# Altium project Intermediate_LCL_Updated.PrjPcb (part 1 of 2)
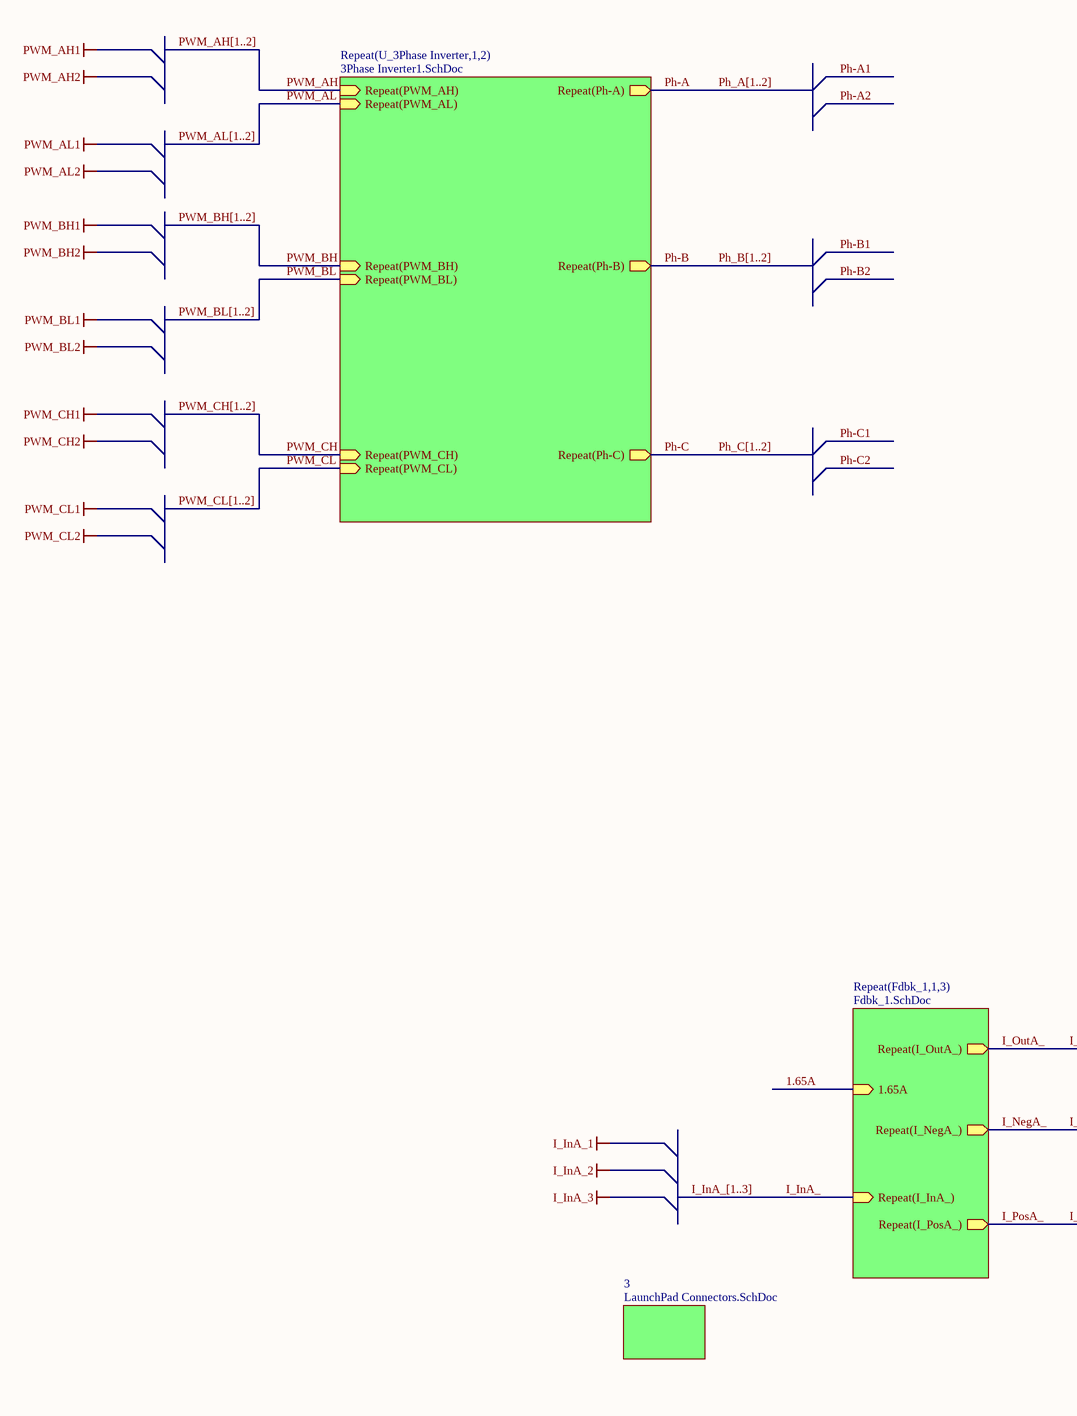
[diagram p0: Intermediate_LCL_Top_20230320.SchDoc, top left]
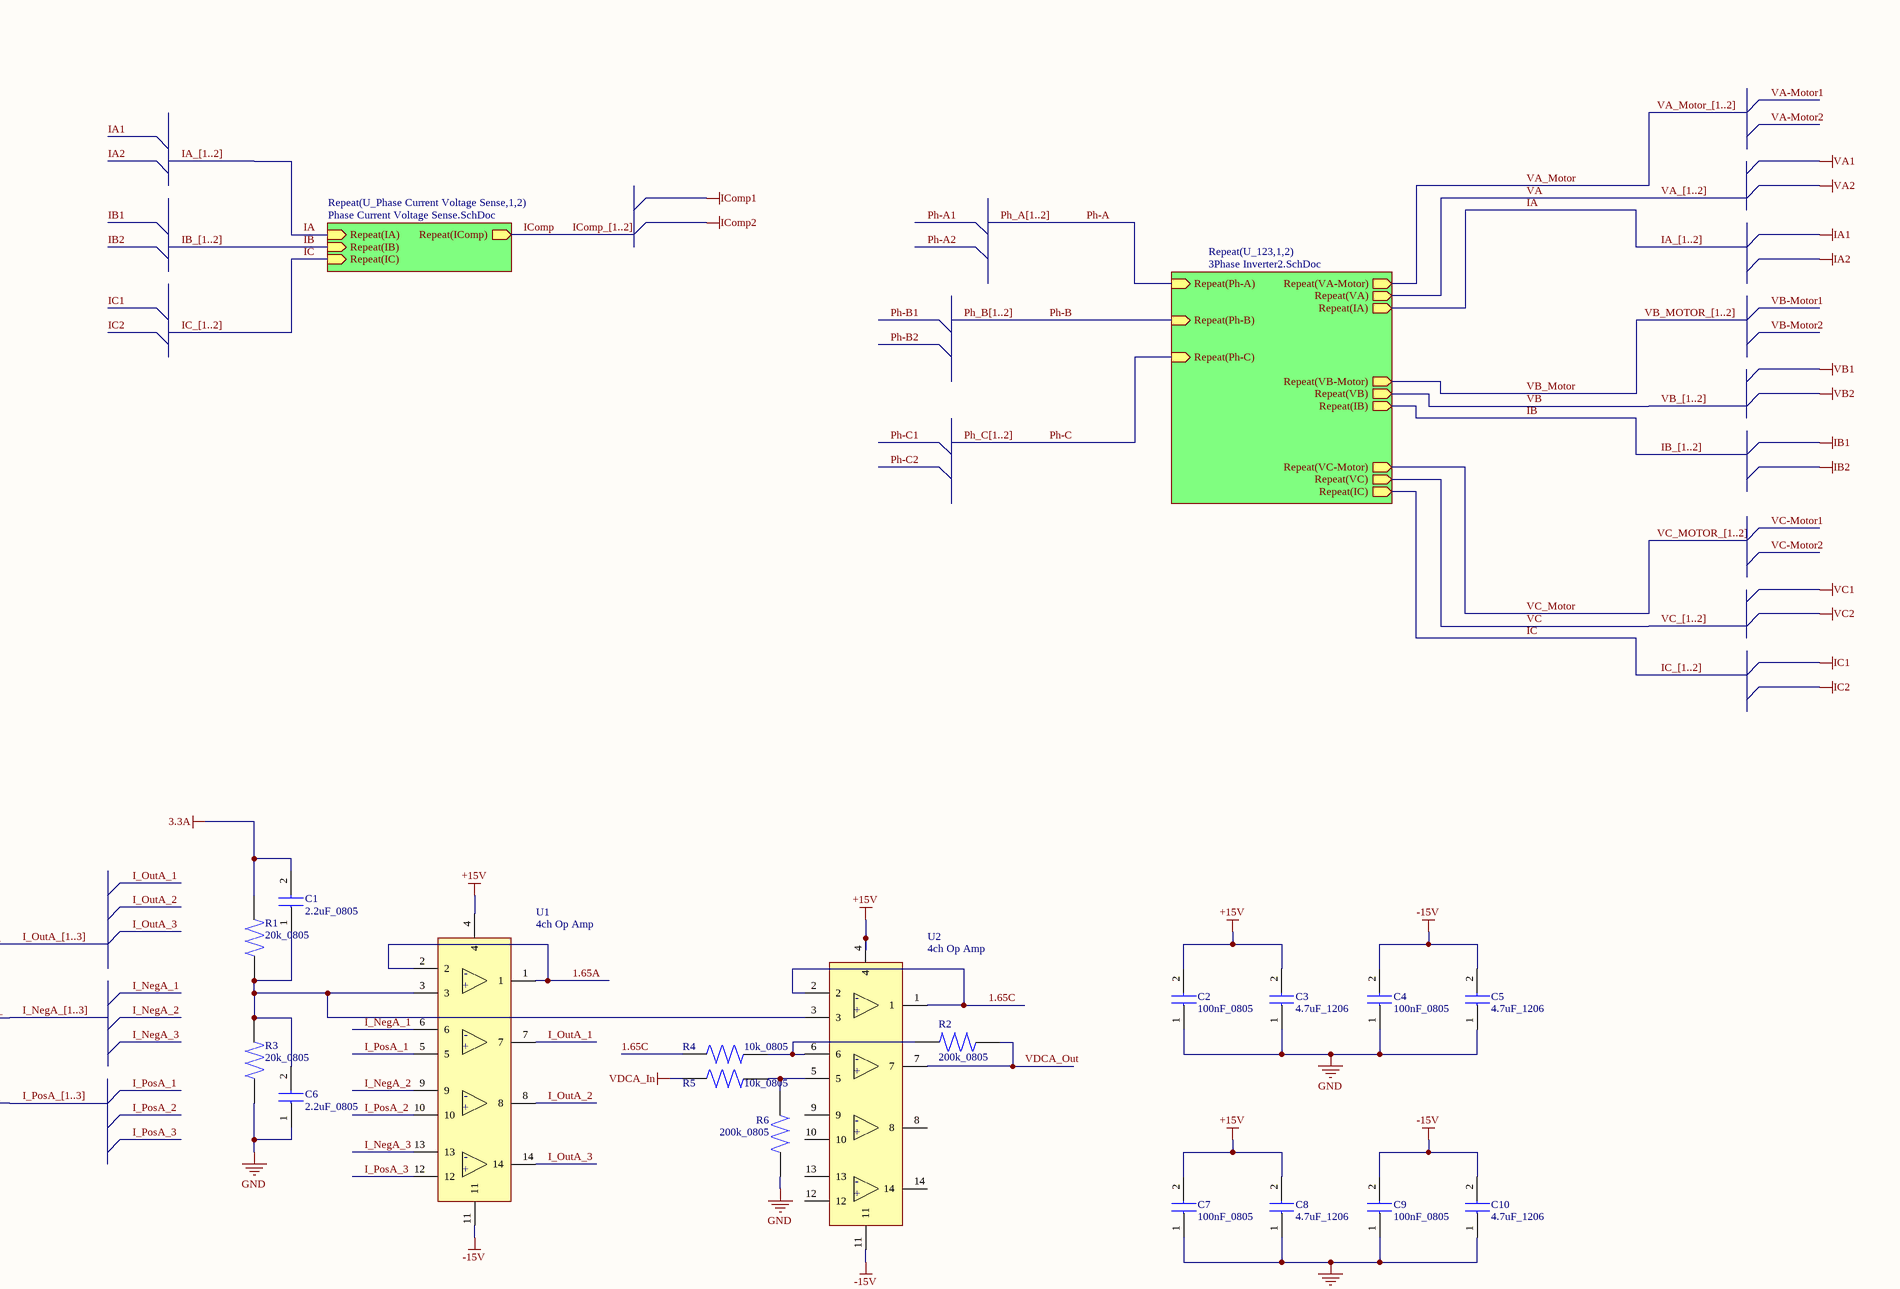
[diagram p1: Intermediate_LCL_Top_20230320.SchDoc, top right]
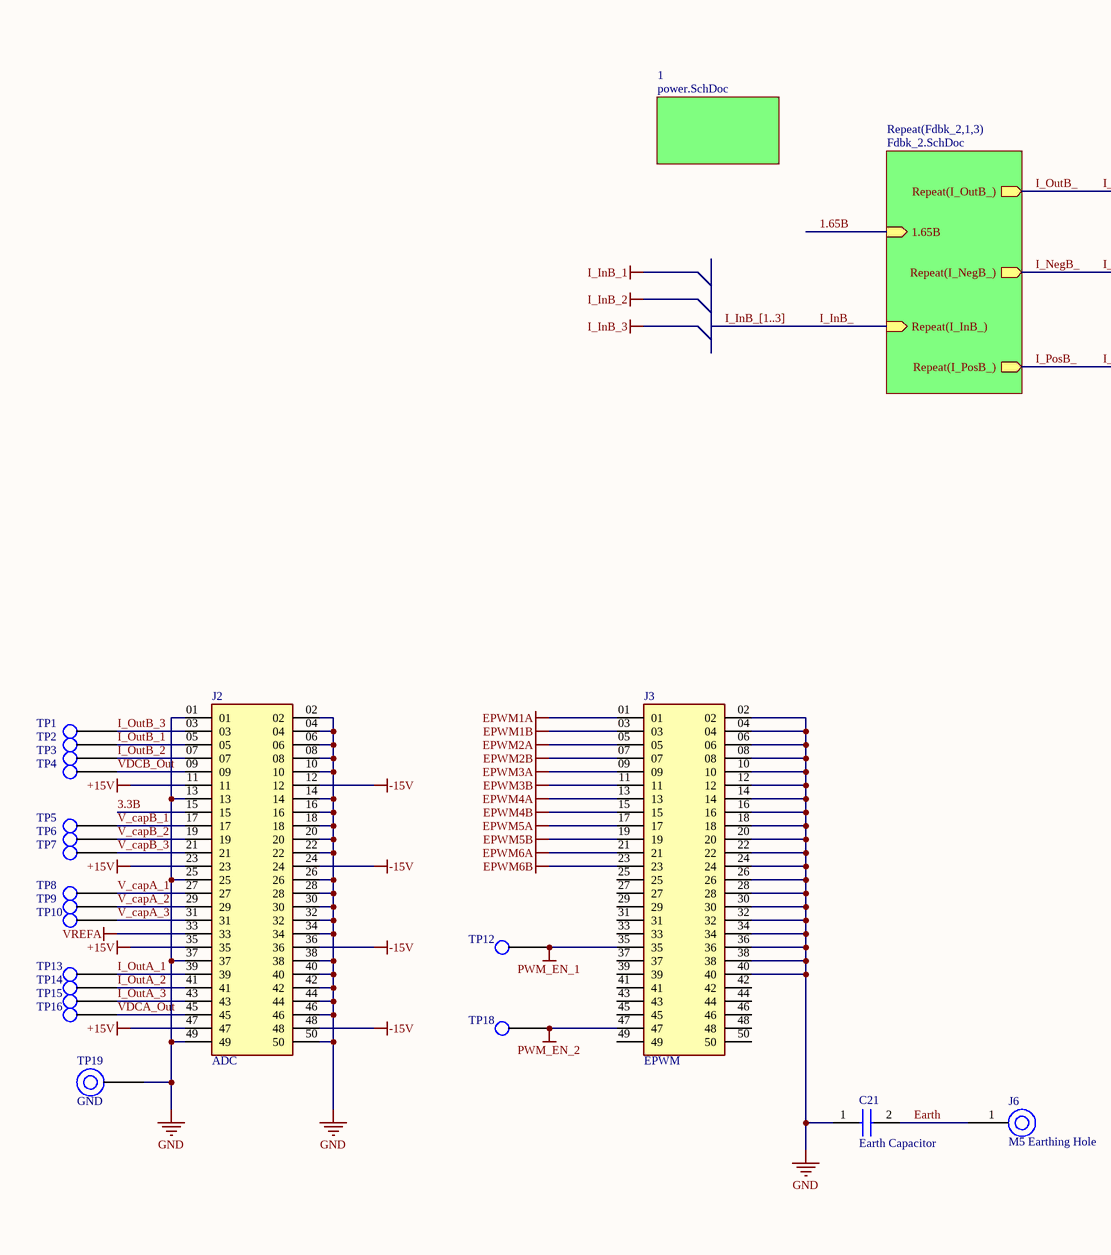
[diagram p2: Intermediate_LCL_Top_20230320.SchDoc, bottom left]
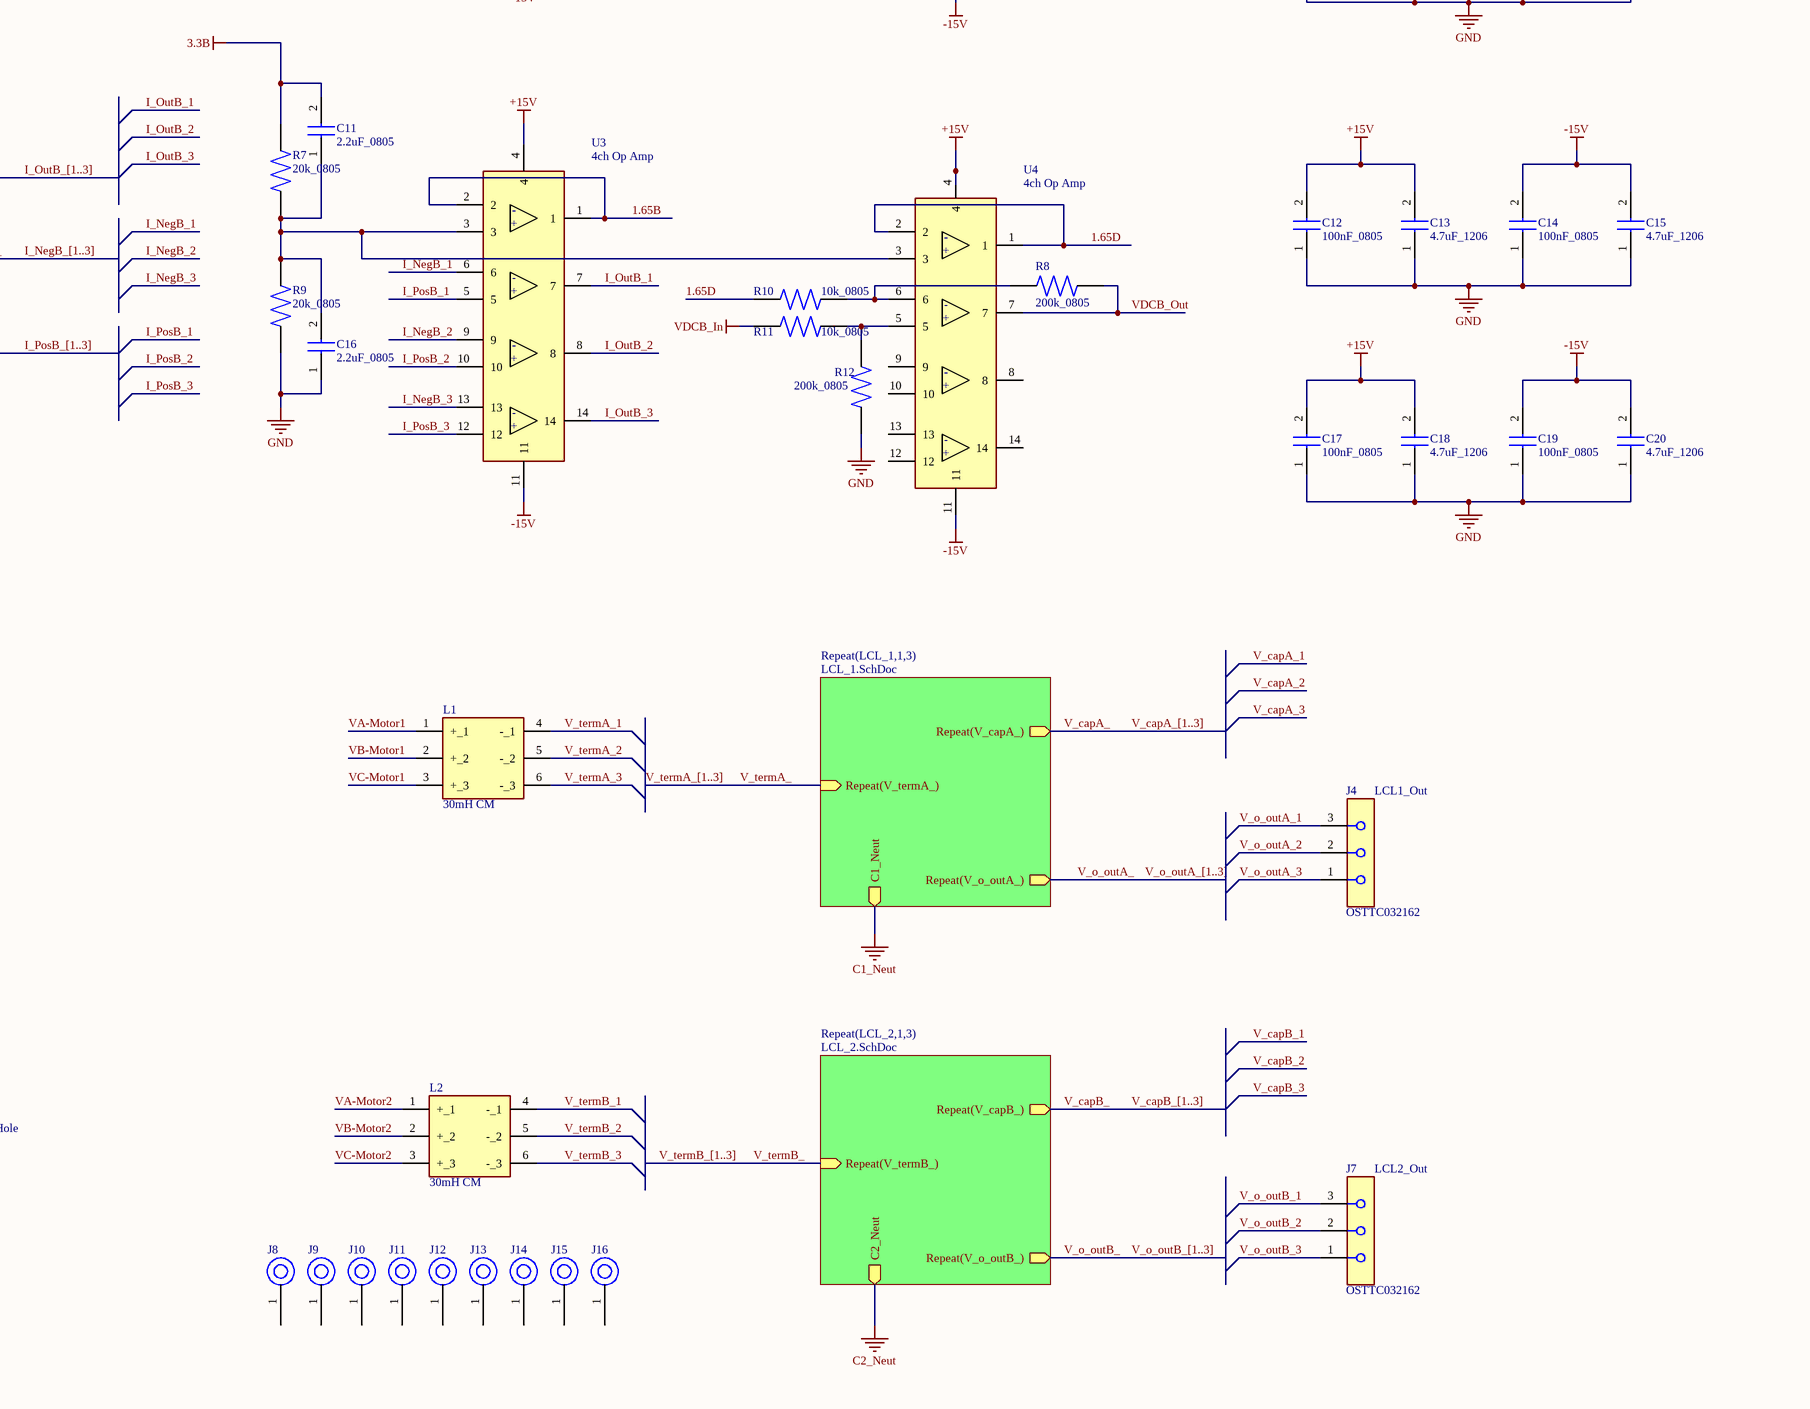
[diagram p3: Intermediate_LCL_Top_20230320.SchDoc, bottom right]
9 sheets, 464 parts. Net scope: hierarchical (ports join the sheet entries above them; power ports are global).
Board file: Intermediate_LCL_Revised_new.PcbDoc
Sheets:
  Intermediate_LCL_Top_20230320.SchDoc
    LCL_11 = LCL_1.SchDoc
    LCL_12 = LCL_1.SchDoc
    LCL_13 = LCL_1.SchDoc
    LCL_21 = LCL_2.SchDoc
    LCL_22 = LCL_2.SchDoc
    LCL_23 = LCL_2.SchDoc
    Fdbk_21 = Fdbk_2.SchDoc
    Fdbk_22 = Fdbk_2.SchDoc
    Fdbk_23 = Fdbk_2.SchDoc
    3 = LaunchPad Connectors.SchDoc
    1 = power.SchDoc
    U_3Phase Inverter1 = 3Phase Inverter1.SchDoc
    U_3Phase Inverter2 = 3Phase Inverter1.SchDoc
    U_1231 = 3Phase Inverter2.SchDoc
    U_1232 = 3Phase Inverter2.SchDoc
    U_Phase Current Voltage Sense1 = Phase Current Voltage Sense.SchDoc
    U_Phase Current Voltage Sense2 = Phase Current Voltage Sense.SchDoc

## Sheet Intermediate_LCL_Top_20230320.SchDoc
size A1; SheetNumber: 1; SheetTotal: 5

### Parts
(Parts that share a designator on the sheet are numbered #1, #2 ... from top to bottom, then left to right.)
C1  2.2uF_0805  [0805 Capacitor]
C2  100nF_0805  [0805 Capacitor]
C3  4.7uF_1206  [1206 Capacitor]
C4  100nF_0805  [0805 Capacitor]
C5  4.7uF_1206  [1206 Capacitor]
C6  2.2uF_0805  [0805 Capacitor]
C7  100nF_0805  [0805 Capacitor]
C8  4.7uF_1206  [1206 Capacitor]
C9#1  100nF_0805  [0805 Capacitor]
C10  4.7uF_1206  [1206 Capacitor]
C11  2.2uF_0805  [0805 Capacitor]
C12  100nF_0805  [0805 Capacitor]
C13  4.7uF_1206  [1206 Capacitor]
C14  100nF_0805  [0805 Capacitor]
C15  4.7uF_1206  [1206 Capacitor]
C16  2.2uF_0805  [0805 Capacitor]
C17  100nF_0805  [0805 Capacitor]
C18  4.7uF_1206  [1206 Capacitor]
C19  100nF_0805  [0805 Capacitor]
C20  4.7uF_1206  [1206 Capacitor]
C21  Earth Capacitor  [RAD-0.3]
J2  ADC  [SHF-125-01-L-D-RA]
J3  EPWM  [SHF-125-01-L-D-RA]
J4  LCL1_Out  Part Number: OSTTC032162  [3 Pin Terminal]
J6  M5 Earthing Hole  [M5 Earthing Hole]
J7  LCL2_Out  Part Number: OSTTC032162  [3 Pin Terminal]
J8  M5 Mounting Hole  [M5 Mounting Hole]  (value not drawn)
J9  M5 Mounting Hole  [M5 Mounting Hole]  (value not drawn)
J10  M5 Mounting Hole  [M5 Mounting Hole]  (value not drawn)
J11  M5 Mounting Hole  [M5 Mounting Hole]  (value not drawn)
J12  M5 Mounting Hole  [M5 Mounting Hole]  (value not drawn)
J13#1  M5 Mounting Hole  [M5 Mounting Hole]  (value not drawn)
J14  M5 Mounting Hole  [M5 Mounting Hole]  (value not drawn)
J15  M5 Mounting Hole  [M5 Mounting Hole]  (value not drawn)
J16  M5 Mounting Hole  [M5 Mounting Hole]  (value not drawn)
L1#1  30mH CM  [CM Choke Custom]
L2  30mH CM  [CM Choke Custom]
R1  20k_0805  [0805 Resistor]
R2  200k_0805  [0805 Resistor]
R3  20k_0805  [0805 Resistor]
R4  10k_0805  [0805 Resistor]
R5  10k_0805  [0805 Resistor]
R6#1  200k_0805  [0805 Resistor]
R7#1  20k_0805  [0805 Resistor]
R8#1  200k_0805  [0805 Resistor]
R9  20k_0805  [0805 Resistor]
R10  10k_0805  [0805 Resistor]
R11  10k_0805  [0805 Resistor]
R12  200k_0805  [0805 Resistor]
TP1  I3  [PCB 1.32mm TestPoint]  (value not drawn)
TP2  I1  [PCB 1.32mm TestPoint]  (value not drawn)
TP3  I2  [PCB 1.32mm TestPoint]  (value not drawn)
TP4  VDC  [PCB 1.32mm TestPoint]  (value not drawn)
TP5  VC_2A  [PCB 1.32mm TestPoint]  (value not drawn)
TP6  VC_2B  [PCB 1.32mm TestPoint]  (value not drawn)
TP7  VC_2C  [PCB 1.32mm TestPoint]  (value not drawn)
TP8  VC_1A  [PCB 1.32mm TestPoint]  (value not drawn)
TP9  VC_1B  [PCB 1.32mm TestPoint]  (value not drawn)
TP10  VC_1C  [PCB 1.32mm TestPoint]  (value not drawn)
TP12  PWMEN1  [PCB 1.32mm TestPoint]  (value not drawn)
TP13  I1  [PCB 1.32mm TestPoint]  (value not drawn)
TP14  I2  [PCB 1.32mm TestPoint]  (value not drawn)
TP15  I3  [PCB 1.32mm TestPoint]  (value not drawn)
TP16  VDC  [PCB 1.32mm TestPoint]  (value not drawn)
TP18  PWMEN2  [PCB 1.32mm TestPoint]  (value not drawn)
TP19  GND  [1.9mm Hole]
U1  4ch Op Amp  [SOIC-14]
U2  4ch Op Amp  [SOIC-14]
U3  4ch Op Amp  [SOIC-14]
U4  4ch Op Amp  [SOIC-14]

### Sub-sheets
1 = power.SchDoc: no entries
3 = LaunchPad Connectors.SchDoc: no entries
Repeat(Fdbk_1,1,3) = Fdbk_1.SchDoc (file not in this document): 1.65A (in), Repeat(I_InA_) (in), Repeat(I_PosA_) (out), Repeat(I_OutA_) (out), Repeat(I_NegA_) (out)
Repeat(Fdbk_2,1,3) = Fdbk_2.SchDoc: 1.65B (in), Repeat(I_InB_) (in), Repeat(I_PosB_) (out), Repeat(I_OutB_) (out), Repeat(I_NegB_) (out)
Repeat(LCL_1,1,3) = LCL_1.SchDoc: Repeat(V_termA_) (in), Repeat(V_o_outA_) (out), Repeat(V_capA_) (out), C1_Neut (out)
Repeat(LCL_2,1,3) = LCL_2.SchDoc: Repeat(V_termB_) (in), Repeat(V_o_outB_) (out), Repeat(V_capB_) (out), C2_Neut (out)
Repeat(U_3Phase Inverter,1,2) = 3Phase Inverter1.SchDoc: Repeat(PWM_AH) (in), Repeat(PWM_AL) (in), Repeat(Ph-A) (out), Repeat(PWM_BH) (in), Repeat(PWM_BL) (in), Repeat(PWM_CH) (in), Repeat(PWM_CL) (in), Repeat(Ph-B) (out), Repeat(Ph-C) (out)
Repeat(U_123,1,2) = 3Phase Inverter2.SchDoc: Repeat(Ph-A) (in), Repeat(VA-Motor) (out), Repeat(VA) (out), Repeat(IA) (out), Repeat(Ph-B) (in), Repeat(Ph-C) (in), Repeat(VB-Motor) (out), Repeat(VB) (out), Repeat(IB) (out), Repeat(VC-Motor) (out), Repeat(VC) (out), Repeat(IC) (out)
Repeat(U_Phase Current Voltage Sense,1,2) = Phase Current Voltage Sense.SchDoc: Repeat(IA) (in), Repeat(IB) (in), Repeat(IC) (in), Repeat(IComp) (out)

### Nets
3.3A: C1.2 R1.2
3.3B: C11.2 J2.15 R7#1.2
+15V: C2.2 C3.2 C7.2 C8.2 C12.2 C13.2 C17.2 C18.2 J2.11 J2.23 J2.35 J2.47 U1.4 U2.4 U3.4 U4.4
-15V: C4.2 C5.2 C9#1.2 C10.2 C14.2 C15.2 C19.2 C20.2 J2.12 J2.24 J2.36 J2.48 U1.11 U2.11 U3.11 U4.11
EPWM1A: J3.01
EPWM1B: J3.03
EPWM2A: J3.05
EPWM2B: J3.07
EPWM3A: J3.09
EPWM3B: J3.11
EPWM4A: J3.13
EPWM4B: J3.15
EPWM5A: J3.17
EPWM5B: J3.19
EPWM6A: J3.21
EPWM6B: J3.23
GND: C2.1 C3.1 C4.1 C5.1 C6.1 C7.1 C8.1 C9#1.1 C10.1 C12.1 C13.1 C14.1 C15.1 C16.1 C17.1 C18.1 C19.1 C20.1 C21.1 J2.01 J2.02 J2.04 J2.06 J2.08 J2.10 J2.13 J2.14 J2.16 J2.18 J2.20 J2.22 J2.25 J2.26 J2.28 J2.30 J2.32 J2.34 J2.37 J2.38 J2.40 J2.42 J2.44 J2.46 J2.49 J2.50 J3.02 J3.04 J3.06 J3.08 J3.10 J3.12 J3.14 J3.16 J3.18 J3.20 J3.22 J3.24 J3.26 J3.28 J3.30 J3.32 J3.34 J3.36 J3.38 J3.40 R3.1 R6#1.2 R9.1 R12.2 TP19.1
PWM_EN_1: J3.35 TP12.1
PWM_EN_2: J3.47 TP18.1
VDCA_In: R5.1
VDCB_In: R11.1
VREFA: J2.33
1.65A: U1.1 U1.2 ; sheet Repeat(Fdbk_1,1,3)/1.65A
1.65B: U3.1 U3.2 ; sheet Repeat(Fdbk_2,1,3)/1.65B
1.65C: R4.1 U2.1 U2.2
1.65D: R10.1 U4.1 U4.2
Earth: C21.2 J6.1
I_InA_: sheet Repeat(Fdbk_1,1,3)/Repeat(I_InA_)
I_InB_: sheet Repeat(Fdbk_2,1,3)/Repeat(I_InB_)
I_NegA_: sheet Repeat(Fdbk_1,1,3)/Repeat(I_NegA_)
I_NegA_1: U1.6
I_NegA_2: U1.9
I_NegA_3: U1.13
I_NegB_: sheet Repeat(Fdbk_2,1,3)/Repeat(I_NegB_)
I_NegB_1: U3.6
I_NegB_2: U3.9
I_NegB_3: U3.13
I_OutA_: sheet Repeat(Fdbk_1,1,3)/Repeat(I_OutA_)
I_OutA_1: J2.39 TP13.1 U1.7
I_OutA_2: J2.41 TP14.1 U1.8
I_OutA_3: J2.43 TP15.1 U1.14
I_OutB_: sheet Repeat(Fdbk_2,1,3)/Repeat(I_OutB_)
I_OutB_1: J2.05 TP2.1 U3.7
I_OutB_2: J2.07 TP3.1 U3.8
I_OutB_3: J2.03 TP1.1 U3.14
I_PosA_: sheet Repeat(Fdbk_1,1,3)/Repeat(I_PosA_)
I_PosA_1: U1.5
I_PosA_2: U1.10
I_PosA_3: U1.12
I_PosB_: sheet Repeat(Fdbk_2,1,3)/Repeat(I_PosB_)
I_PosB_1: U3.5
I_PosB_2: U3.10
I_PosB_3: U3.12
IA: sheet Repeat(U_123,1,2)/Repeat(IA), sheet Repeat(U_Phase Current Voltage Sense,1,2)/Repeat(IA)
IB: sheet Repeat(U_123,1,2)/Repeat(IB), sheet Repeat(U_Phase Current Voltage Sense,1,2)/Repeat(IB)
IC: sheet Repeat(U_123,1,2)/Repeat(IC), sheet Repeat(U_Phase Current Voltage Sense,1,2)/Repeat(IC)
IComp: sheet Repeat(U_Phase Current Voltage Sense,1,2)/Repeat(IComp)
Ph-A: sheet Repeat(U_3Phase Inverter,1,2)/Repeat(Ph-A), sheet Repeat(U_123,1,2)/Repeat(Ph-A)
Ph-B: sheet Repeat(U_3Phase Inverter,1,2)/Repeat(Ph-B), sheet Repeat(U_123,1,2)/Repeat(Ph-B)
Ph-C: sheet Repeat(U_3Phase Inverter,1,2)/Repeat(Ph-C), sheet Repeat(U_123,1,2)/Repeat(Ph-C)
PWM_AH: sheet Repeat(U_3Phase Inverter,1,2)/Repeat(PWM_AH)
PWM_AL: sheet Repeat(U_3Phase Inverter,1,2)/Repeat(PWM_AL)
PWM_BH: sheet Repeat(U_3Phase Inverter,1,2)/Repeat(PWM_BH)
PWM_BL: sheet Repeat(U_3Phase Inverter,1,2)/Repeat(PWM_BL)
PWM_CH: sheet Repeat(U_3Phase Inverter,1,2)/Repeat(PWM_CH)
PWM_CL: sheet Repeat(U_3Phase Inverter,1,2)/Repeat(PWM_CL)
V_capA_: sheet Repeat(LCL_1,1,3)/Repeat(V_capA_)
V_capA_1: J2.27 TP8.1  [project net V_capA]
V_capA_2: J2.29 TP9.1  [project net V_capA]
V_capA_3: J2.31 TP10.1  [project net V_capA]
V_capB_: sheet Repeat(LCL_2,1,3)/Repeat(V_capB_)
V_capB_1: J2.17 TP5.1  [project net V_capB]
V_capB_2: J2.19 TP6.1  [project net V_capB]
V_capB_3: J2.21 TP7.1  [project net V_capB]
V_o_outA_: sheet Repeat(LCL_1,1,3)/Repeat(V_o_outA_)
V_o_outA_1: J4.3  [project net V_o_outA]
V_o_outA_2: J4.2  [project net V_o_outA]
V_o_outA_3: J4.1  [project net V_o_outA]
V_o_outB_: sheet Repeat(LCL_2,1,3)/Repeat(V_o_outB_)
V_o_outB_1: J7.3  [project net V_o_outB]
V_o_outB_2: J7.2  [project net V_o_outB]
V_o_outB_3: J7.1  [project net V_o_outB]
V_termA_: sheet Repeat(LCL_1,1,3)/Repeat(V_termA_)
V_termA_1: L1#1.4(-_1)
V_termA_2: L1#1.5(-_2)
V_termA_3: L1#1.6(-_3)
V_termB_: sheet Repeat(LCL_2,1,3)/Repeat(V_termB_)
V_termB_1: L2.4(-_1)
V_termB_2: L2.5(-_2)
V_termB_3: L2.6(-_3)
VA: sheet Repeat(U_123,1,2)/Repeat(VA)
VA-Motor1: L1#1.1(+_1)
VA-Motor2: L2.1(+_1)
VA_Motor: sheet Repeat(U_123,1,2)/Repeat(VA-Motor)
VB: sheet Repeat(U_123,1,2)/Repeat(VB)
VB-Motor1: L1#1.2(+_2)
VB-Motor2: L2.2(+_2)
VB_Motor: sheet Repeat(U_123,1,2)/Repeat(VB-Motor)
VC: sheet Repeat(U_123,1,2)/Repeat(VC)
VC-Motor1: L1#1.3(+_3)
VC-Motor2: L2.3(+_3)
VC_Motor: sheet Repeat(U_123,1,2)/Repeat(VC-Motor)
VDCA_Out: J2.45 R2.1 TP16.1 U2.7
VDCB_Out: J2.09 R8#1.1 TP4.1 U4.7
NetC1_1: C1.1 C6.2 R1.1 R3.2 U1.3 U2.3
NetC11_1: C11.1 C16.2 R7#1.1 R9.2 U3.3 U4.3
NetR2_2: R2.2 R4.2 U2.6
NetR5_2: R5.2 R6#1.1 U2.5
NetR8#1_2: R8#1.2 R10.2 U4.6
NetR11_2: R11.2 R12.1 U4.5

Not connected (* = marked no-connect by the designer): J3 25 27 29 31 33 37 39 41 42 43 44 45 46 48 49 50; J8 1; J9 1; J10 1; J11 1; J12 1; J13#1 1; J14 1; J15 1; J16 1; U2 8 9 10 12 13 14; U4 8 9 10 12 13 14

### Buses and harness runs
bus I_InA_[1..3]
bus I_InB_[1..3]
bus I_NegA_[1..3]
bus I_NegB_[1..3]
bus I_OutA_[1..3]
bus I_OutB_[1..3]
bus I_PosA_[1..3]
bus I_PosB_[1..3]
bus IA_[1..2]
bus IB_[1..2]
bus IC_[1..2]
bus IComp_[1..2]
bus Ph_A[1..2]
bus Ph_B[1..2]
bus Ph_C[1..2]
bus PWM_AH[1..2]
bus PWM_AL[1..2]
bus PWM_BH[1..2]
bus PWM_BL[1..2]
bus PWM_CH[1..2]
bus PWM_CL[1..2]
bus V_capA_[1..3]
bus V_capB_[1..3]
bus V_o_outA_[1..3]
bus V_o_outB_[1..3]
bus V_termA_[1..3]
bus V_termB_[1..3]
bus VA_[1..2]
bus VA_Motor_[1..2]
bus VB_[1..2]
bus VB_MOTOR_[1..2]
bus VC_[1..2]
bus VC_MOTOR_[1..2]

### Notes on the sheet
- (in symbol TL074D) -; +

### Library data of the parts
C1 C6 C11 C16 = C2012X5R1H225K125AB: SMD Multilayer Ceramic Capacitor, 2.2 µF, 50 V, 0805 [2012 Metric], ± 10%, X5R, C
C2 C4 C7 C9#1 C12 C14 C17 C19 = C0805C104J5RACTU: SMD Multilayer Ceramic Capacitor, 0.1 µF, 50 V, 0805 [2012 Metric], ± 5%, X7R, C Series KEMET
C3 C5 C8 C10 C13 C15 C18 C20 = C3216X7R1H475K160AC: SMD Multilayer Ceramic Capacitor, 4.7 µF, 50 V, 1206 [3216 Metric], ± 10%, X7R, C; MP: C1206C120J5GACTU; Package: None; Price: None; Value: *; Availability: Unavailable
C21 = 102_Y: Y Earth Capacitor; MP: C1206C120J5GACTU; Package: None; Price: None; Value: *; Availability: Unavailable
J2 J3 = SHF-125-01-L-D-RA: 50-Pin Simplus Connector; MF: Samtec; MP: SHF-125-01-L-D-RA; Package: None; Price: None; Availability: Unavailable; Value: *
J4 J7 = 3PinTerminal: 3 Position Terminal Block 5.08mm; Manufacturer: On Shore Technology; Voltage: 300V; Is Female: yes; helpURL: https://upverter.com/upn/revision/2b80058b23306b34/; ComponentLink2Description: Datasheet; Temperature: -30°C to +105°C; Package: HDR03; Supplier 2: Mouser; Price: 0.382016875697; Supplier 1: Digi-Key; ComponentLink1URL: https://upverter.com/upn/revision/2b80058b23306b34/; Supplier Part Number 1: ED2610-ND; ComponentLink1Description: Upverter; ComponentLink2URL: https://upverter.com/datasheet/d9a5d2e095ec14efdc364e45047c257fc4ca76eb.pdf; RoHS: TRUE; Temperature Range High: +105°C; Digikey Description: CONN TERM BLOCK 5.08MM VERT 3POS PCB; Digikey Part Number: ED2610-ND; Lead Free: yes; Temperature Range Low: -30°C
L1#1 L2 = 30mH Custom CM Choke: Manufacturer_Name: Wurth Elektronik; Manufacturer_Part_Number: 744839029220; Datasheet Link: https://componentsearchengine.com//744839029220.pdf; Height: 39mm; Mouser Part Number: 710-744839029220; Mouser Price/Stock: https://www.mouser.co.uk/ProductDetail/Wurth-Elektronik/744839029220?qs=MoCBKJu1Jj15mDhjF%2F4U%252Bg%3D%3D
R1 R3 R7#1 R9 = CRCW080520K0FKEA: SMD Chip Resistor, 20 kohm, ± 1%, 125 mW, 0805 [2012 Metric], Thick Film, General Purpose; MF: Bourns; MP: CRE2512-FZ-R007E-3; Mouser-Purchase-URL: https://snapeda.com/shop?store=Mouser&id=836123; Price: None; Package: 6432 Stackpole; Value: *; SnapEDA_Link: https://www.snapeda.com/parts/CRE2512-FZ-R007E-3/Bourns/view-part/836123/?ref=snap; DigiKey-Purchase-URL: https://snapeda.com/shop?store=DigiKey&id=836123; Availability: Good
R2 R6#1 R8#1 R12 = CRCW0805200KFKEA: SMD Chip Resistor, 200 kohm, ± 1%, 125 mW, 0805 [2012 Metric], Thick Film, General Purpose; MF: Bourns; MP: CRE2512-FZ-R007E-3; Mouser-Purchase-URL: https://snapeda.com/shop?store=Mouser&id=836123; Price: None; Package: 6432 Stackpole; Value: *; SnapEDA_Link: https://www.snapeda.com/parts/CRE2512-FZ-R007E-3/Bourns/view-part/836123/?ref=snap; DigiKey-Purchase-URL: https://snapeda.com/shop?store=DigiKey&id=836123; Availability: Good
R4 R5 R10 R11 = CRCW080510K0FKEA: SMD Chip Resistor, 10 kohm, ± 1%, 125 mW, 0805 [2012 Metric], Thick Film, General Purpose; MF: Bourns; MP: CRE2512-FZ-R007E-3; Mouser-Purchase-URL: https://snapeda.com/shop?store=Mouser&id=836123; Price: None; Package: 6432 Stackpole; Value: *; SnapEDA_Link: https://www.snapeda.com/parts/CRE2512-FZ-R007E-3/Bourns/view-part/836123/?ref=snap; DigiKey-Purchase-URL: https://snapeda.com/shop?store=DigiKey&id=836123; Availability: Good
TP1-TP10 TP12-TP16 TP18 = PCBTestpoint: 20-313143 PCB Test Point, White, Through Hole Mount, 1.32 mm, Phosphor Bronze, Tin Plated Contacts
TP19 = GroundTestPoint: H2182-01 PCB Test Point, PCB Mount, 1.9 mm, Brass, Tin Plated Contacts
U1-U4 = TL074D: Quad, 30-V, 3-MHz, high slew rate (13-V/µs), In to V+, JFET-input op amp

## Sheet LCL_1.SchDoc
size A4; SheetNumber: 2; SheetTotal: 5
Used 3 times, as channels LCL_11, LCL_12, LCL_13. Parts and nets are listed once, with the designators drawn on the sheet.
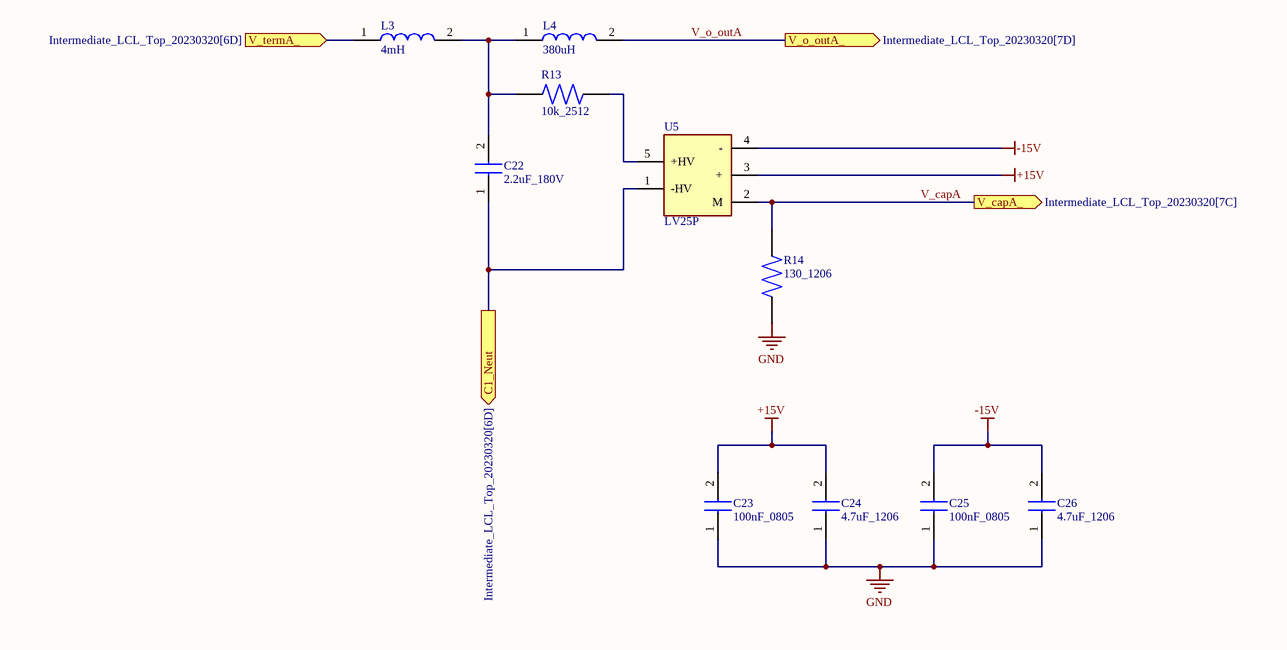
[diagram p4: LCL_1.SchDoc]

### Parts
C22  2.2uF_180V  [Film Capacitor PHE450HF7220JR06L2]
C23  100nF_0805  [0805 Capacitor]
C24  4.7uF_1206  [1206 Capacitor]
C25  100nF_0805  [0805 Capacitor]
C26  4.7uF_1206  [1206 Capacitor]
L3  4mH  [4mH Custom]
L4  380uH  [380uH Custom]
R13  10k_2512  [2512 Resistor]
R14  130_1206  [1206 Resistor]
U5  LV25P  [LV-25-P]

### Ports
C1_Neut (out, see Intermediate_LCL_Top_20230320[6D]), V_capA_ (out, see Intermediate_LCL_Top_20230320[7C]), V_o_outA_ (out, see Intermediate_LCL_Top_20230320[7D]), V_termA_ (in, see Intermediate_LCL_Top_20230320[6D])

### Nets
+15V: C23.2 C24.2 U5.3(+)
-15V: C25.2 C26.2 U5.4(-)
GND: C23.1 C24.1 C25.1 C26.1 R14.1
C1_Neut: C22.1 U5.1(-HV) ; port C1_Neut
V_capA: R14.2 U5.2(M) ; port V_capA_
V_o_outA: L4.2 ; port V_o_outA_
V_termA_: L3.1 ; port V_termA_
NetC22_2: C22.2 L3.2 L4.1 R13.1
NetR13_2: R13.2 U5.5(+HV)

### Channels
LCL_11: designators end in _1; ports C1_Neut=C1_Neut V_capA_=V_capA V_o_outA_=V_o_outA V_termA_=V_termA_1
LCL_12: designators end in _2; ports C1_Neut=C1_Neut V_capA_=V_capA V_o_outA_=V_o_outA V_termA_=V_termA_2
LCL_13: designators end in _3; ports C1_Neut=C1_Neut V_capA_=V_capA V_o_outA_=V_o_outA V_termA_=V_termA_3

### Library data of the parts
C22 = PHE450HF7220JR06L2: KEMET PHE450 Metallised Polypropylene Film Capacitor, 180 V ac, 250 V dc, ±5%, 2.2μF, Through Hole; Datasheet Link: https://docs.rs-online.com/a458/0900766b817170df.pdf; Height: 24.5mm; Manufacturer_Name: KEMET; Manufacturer_Part_Number: PHE450HF7220JR06L2
C23 C25 = C0805C104J5RACTU: as C2 on sheet Intermediate_LCL_Top_20230320
C24 C26 = C3216X7R1H475K160AC: as C3 on sheet Intermediate_LCL_Top_20230320; Package: None; Price: None; Value: *; Availability: Unavailable
L3 = 4mH Custom Inductor
L4 = 380uH Custom Inductor
R13 = MCHP122WF1002T4E: SMD Chip Resistor, 10 kohm, ± 1%, 2 W, 2512 [6432 Metric], Thick Film, High Power; MF: Bourns; MP: CRE2512-FZ-R007E-3; Mouser-Purchase-URL: https://snapeda.com/shop?store=Mouser&id=836123; Price: None; Package: 6432 Stackpole; Value: *; SnapEDA_Link: https://www.snapeda.com/parts/CRE2512-FZ-R007E-3/Bourns/view-part/836123/?ref=snap; DigiKey-Purchase-URL: https://snapeda.com/shop?store=DigiKey&id=836123; Availability: Good
R14 = CRCW1206130RFKEA: SMD Chip Resistor, 130 ohm, ± 1%, 250 mW, 1206 [3216 Metric], Thick Film, General Purpose; MF: Bourns; MP: CRE2512-FZ-R007E-3; Mouser-Purchase-URL: https://snapeda.com/shop?store=Mouser&id=836123; Price: None; Package: 6432 Stackpole; Value: *; SnapEDA_Link: https://www.snapeda.com/parts/CRE2512-FZ-R007E-3/Bourns/view-part/836123/?ref=snap; DigiKey-Purchase-URL: https://snapeda.com/shop?store=DigiKey&id=836123; Availability: Good
U5 = LV25P: Undefined or Miscellaneous; Manufacturer_Name: LEM; Manufacturer_Part_Number: LV25P

## Sheet LCL_2.SchDoc
size A4; SheetNumber: 3; SheetTotal: 5
Used 3 times, as channels LCL_21, LCL_22, LCL_23. Parts and nets are listed once, with the designators drawn on the sheet.
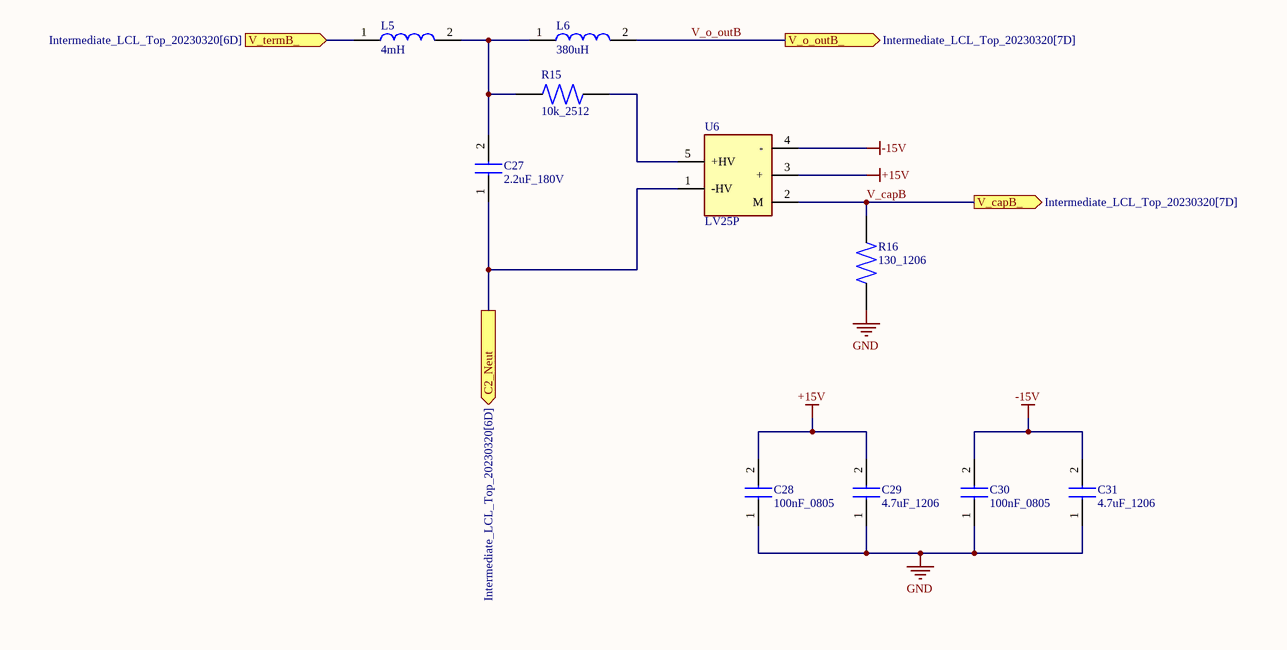
[diagram p5: LCL_2.SchDoc]

### Parts
C27  2.2uF_180V  [Film Capacitor PHE450HF7220JR06L2]
C28  100nF_0805  [0805 Capacitor]
C29  4.7uF_1206  [1206 Capacitor]
C30  100nF_0805  [0805 Capacitor]
C31  4.7uF_1206  [1206 Capacitor]
L5  4mH  [4mH Custom]
L6  380uH  [380uH Custom]
R15  10k_2512  [2512 Resistor]
R16  130_1206  [1206 Resistor]
U6  LV25P  [LV-25-P]

### Ports
C2_Neut (out, see Intermediate_LCL_Top_20230320[6D]), V_capB_ (out, see Intermediate_LCL_Top_20230320[7D]), V_o_outB_ (out, see Intermediate_LCL_Top_20230320[7D]), V_termB_ (in, see Intermediate_LCL_Top_20230320[6D])

### Nets
+15V: C28.2 C29.2 U6.3(+)
-15V: C30.2 C31.2 U6.4(-)
GND: C28.1 C29.1 C30.1 C31.1 R16.1
C2_Neut: C27.1 U6.1(-HV) ; port C2_Neut
V_capB: R16.2 U6.2(M) ; port V_capB_
V_o_outB: L6.2 ; port V_o_outB_
V_termB_: L5.1 ; port V_termB_
NetC27_2: C27.2 L5.2 L6.1 R15.1
NetR15_2: R15.2 U6.5(+HV)

### Channels
LCL_21: designators end in _1; ports C2_Neut=C2_Neut V_capB_=V_capB V_o_outB_=V_o_outB V_termB_=V_termB_1
LCL_22: designators end in _2; ports C2_Neut=C2_Neut V_capB_=V_capB V_o_outB_=V_o_outB V_termB_=V_termB_2
LCL_23: designators end in _3; ports C2_Neut=C2_Neut V_capB_=V_capB V_o_outB_=V_o_outB V_termB_=V_termB_3

### Library data of the parts
C27 = PHE450HF7220JR06L2: as C22 on sheet LCL_1; Datasheet Link: https://docs.rs-online.com/a458/0900766b817170df.pdf; Height: 24.5mm; Manufacturer_Name: KEMET; Manufacturer_Part_Number: PHE450HF7220JR06L2
C28 C30 = C0805C104J5RACTU: as C2 on sheet Intermediate_LCL_Top_20230320
C29 C31 = C3216X7R1H475K160AC: as C3 on sheet Intermediate_LCL_Top_20230320; Package: None; Price: None; Value: *; Availability: Unavailable
L5 = 4mH Custom Inductor
L6 = 380uH Custom Inductor
R15 = MCHP122WF1002T4E: as R13 on sheet LCL_1; Mouser-Purchase-URL: https://snapeda.com/shop?store=Mouser&id=836123; Price: None; Package: 6432 Stackpole; Value: *; SnapEDA_Link: https://www.snapeda.com/parts/CRE2512-FZ-R007E-3/Bourns/view-part/836123/?ref=snap; DigiKey-Purchase-URL: https://snapeda.com/shop?store=DigiKey&id=836123; Availability: Good
R16 = CRCW1206130RFKEA: as R14 on sheet LCL_1; Mouser-Purchase-URL: https://snapeda.com/shop?store=Mouser&id=836123; Price: None; Package: 6432 Stackpole; Value: *; SnapEDA_Link: https://www.snapeda.com/parts/CRE2512-FZ-R007E-3/Bourns/view-part/836123/?ref=snap; DigiKey-Purchase-URL: https://snapeda.com/shop?store=DigiKey&id=836123; Availability: Good
U6 = LV25P: as U5 on sheet LCL_1; Manufacturer_Part_Number: LV25P

## Sheet Fdbk_2.SchDoc
size A4; SheetNumber: 4; SheetTotal: 5
Used 3 times, as channels Fdbk_21, Fdbk_22, Fdbk_23. Parts and nets are listed once, with the designators drawn on the sheet.
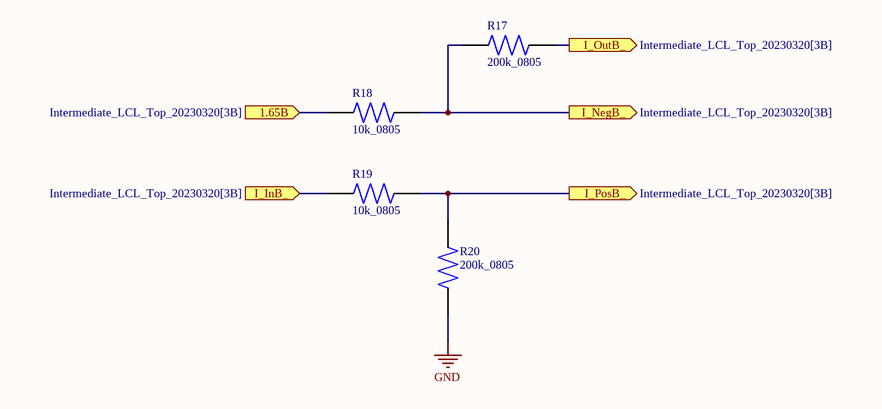
[diagram p6: Fdbk_2.SchDoc]

### Parts
R17  200k_0805  [0805 Resistor]
R18  10k_0805  [0805 Resistor]
R19  10k_0805  [0805 Resistor]
R20  200k_0805  [0805 Resistor]

### Ports
1.65B (in, see Intermediate_LCL_Top_20230320[3B]), I_InB_ (in, see Intermediate_LCL_Top_20230320[3B]), I_NegB_ (out, see Intermediate_LCL_Top_20230320[3B]), I_OutB_ (out, see Intermediate_LCL_Top_20230320[3B]), I_PosB_ (out, see Intermediate_LCL_Top_20230320[3B])

### Nets
GND: R20.1
1.65B: R18.1 ; port 1.65B
I_InB_: R19.1 ; port I_InB_
I_NegB_: R17.1 R18.2 ; port I_NegB_
I_OutB_: R17.2 ; port I_OutB_
I_PosB_: R19.2 R20.2 ; port I_PosB_

### Channels
Fdbk_21: designators end in _1; ports 1.65B=1.65B I_InB_=I_InB_1 I_NegB_=I_NegB_1 I_OutB_=I_OutB_1 I_PosB_=I_PosB_1
Fdbk_22: designators end in _2; ports 1.65B=1.65B I_InB_=I_InB_2 I_NegB_=I_NegB_2 I_OutB_=I_OutB_2 I_PosB_=I_PosB_2
Fdbk_23: designators end in _3; ports 1.65B=1.65B I_InB_=I_InB_3 I_NegB_=I_NegB_3 I_OutB_=I_OutB_3 I_PosB_=I_PosB_3

### Library data of the parts
R17 R20 = CRCW0805200KFKEA: as R2 on sheet Intermediate_LCL_Top_20230320; Mouser-Purchase-URL: https://snapeda.com/shop?store=Mouser&id=836123; Price: None; Package: 6432 Stackpole; Value: *; SnapEDA_Link: https://www.snapeda.com/parts/CRE2512-FZ-R007E-3/Bourns/view-part/836123/?ref=snap; DigiKey-Purchase-URL: https://snapeda.com/shop?store=DigiKey&id=836123; Availability: Good
R18 R19 = CRCW080510K0FKEA: as R4 on sheet Intermediate_LCL_Top_20230320; Mouser-Purchase-URL: https://snapeda.com/shop?store=Mouser&id=836123; Price: None; Package: 6432 Stackpole; Value: *; SnapEDA_Link: https://www.snapeda.com/parts/CRE2512-FZ-R007E-3/Bourns/view-part/836123/?ref=snap; DigiKey-Purchase-URL: https://snapeda.com/shop?store=DigiKey&id=836123; Availability: Good

## Sheet LaunchPad Connectors.SchDoc
size A2
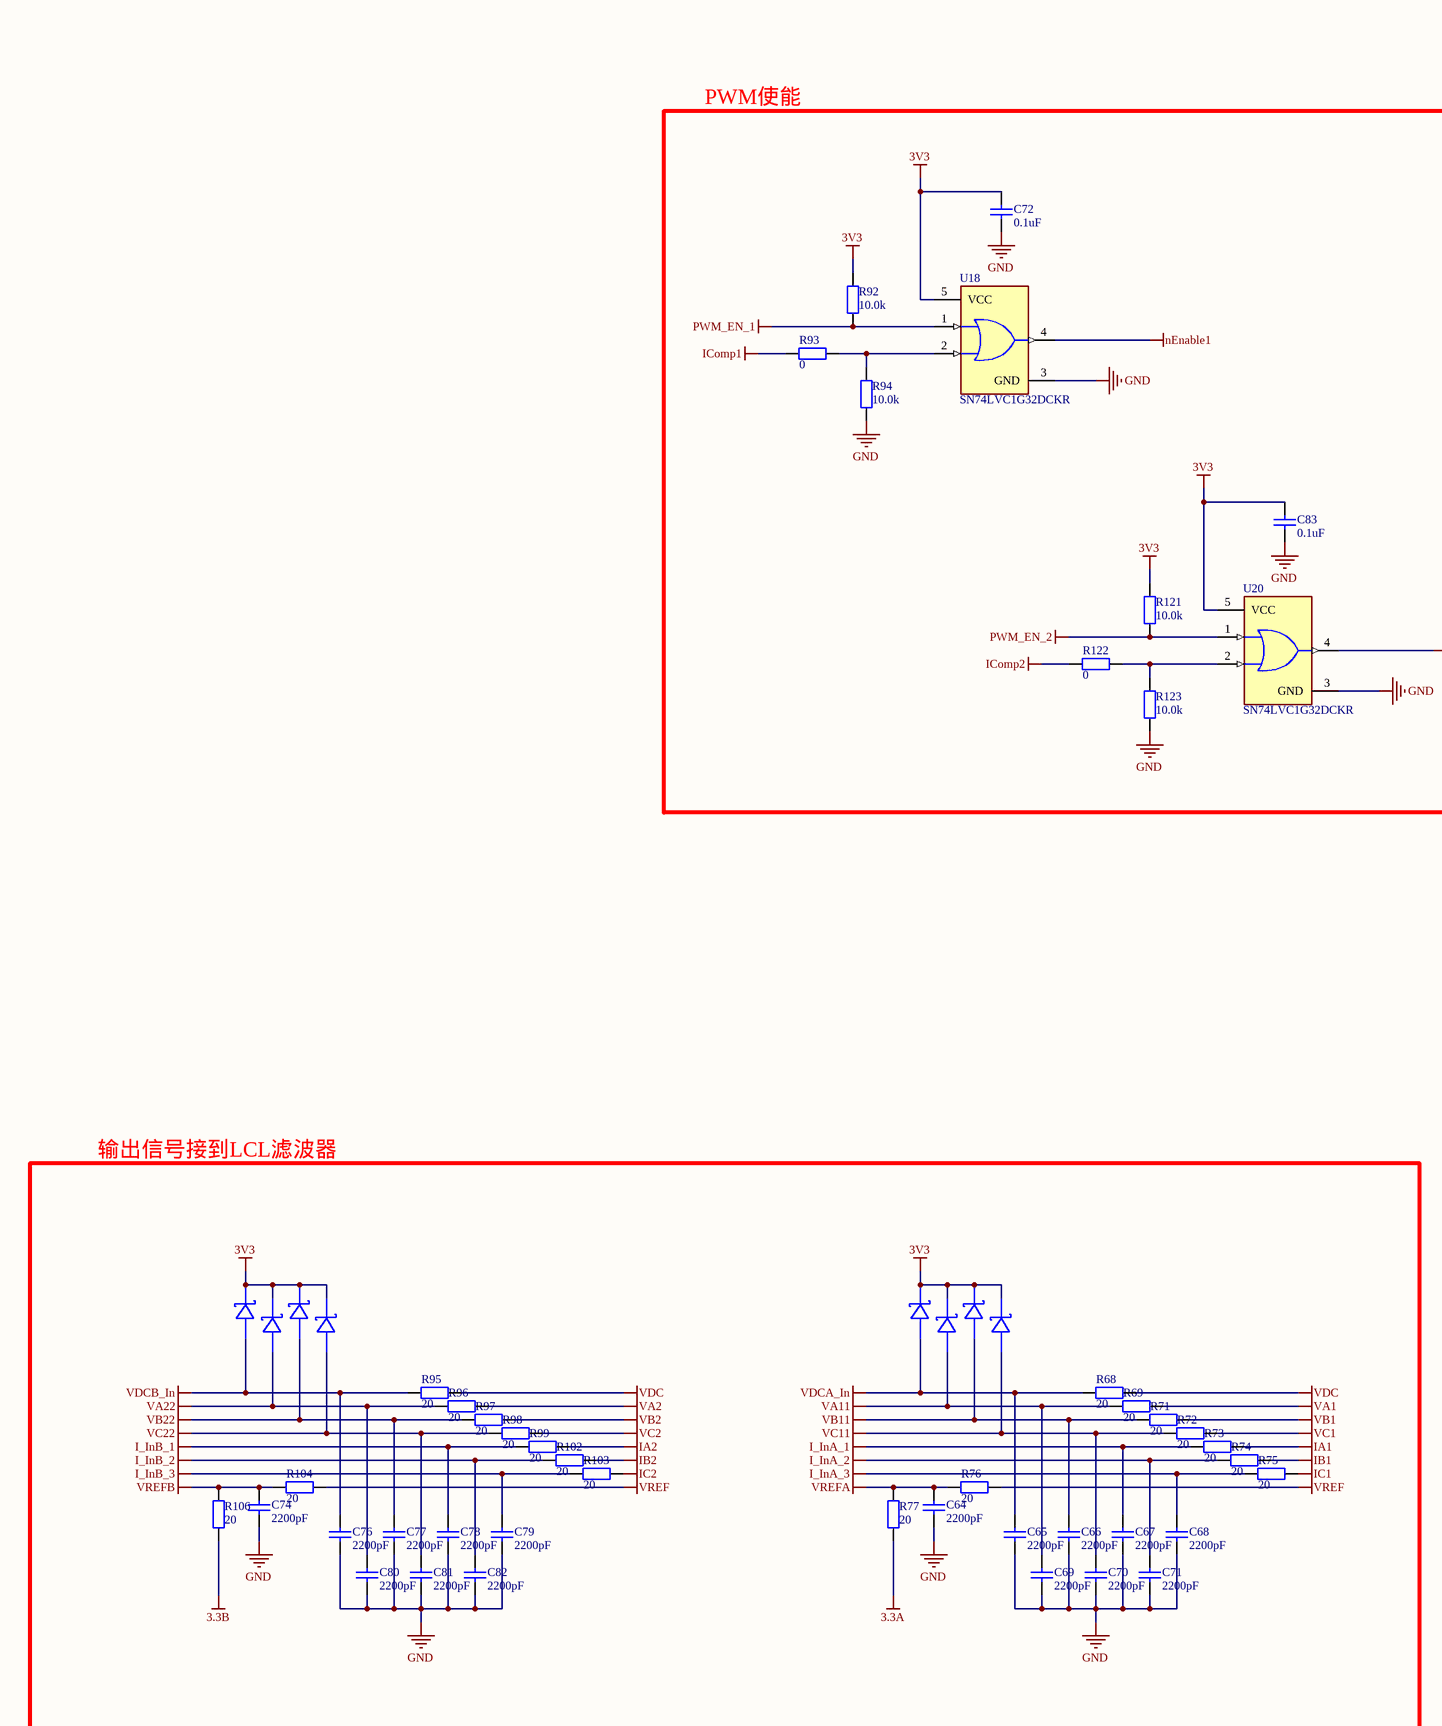
[diagram p7: LaunchPad Connectors.SchDoc, left]
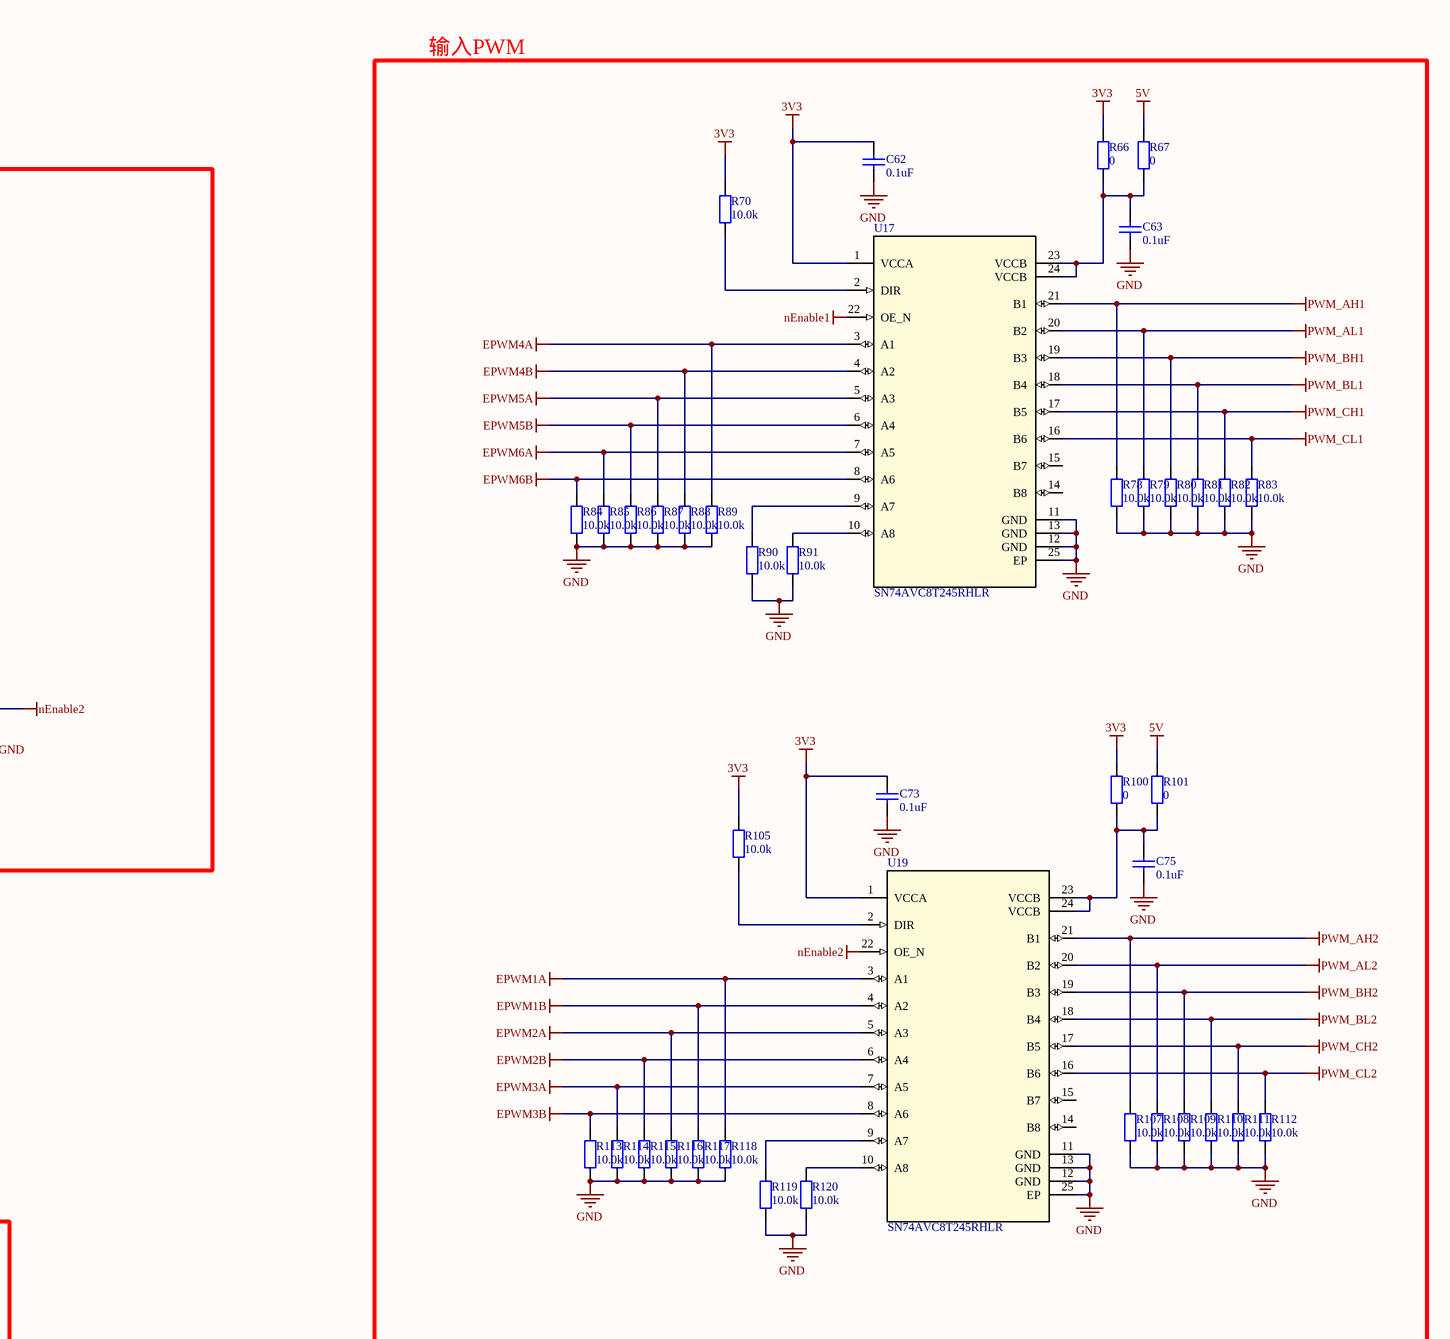
[diagram p8: LaunchPad Connectors.SchDoc, right]

### Parts
(Parts that share a designator on the sheet are numbered #1, #2 ... from top to bottom, then left to right.)
C62  0.1uF  [CAPC1608X06N]
C63  0.1uF  [CAPC1608X06N]
C64  2200pF  [CAPC1608X06N]
C65  2200pF  [CAPC1608X06N]
C66  2200pF  [CAPC1608X06N]
C67  2200pF  [CAPC1608X06N]
C68  2200pF  [CAPC1608X06N]
C69  2200pF  [CAPC1608X06N]
C70  2200pF  [CAPC1608X06N]
C71  2200pF  [CAPC1608X06N]
C72  0.1uF  [CAPC1608X06N]
C73  0.1uF  [CAPC1608X06N]
C74  2200pF  [CAPC1608X06N]
C75  0.1uF  [CAPC1608X06N]
C76  2200pF  [CAPC1608X06N]
C77  2200pF  [CAPC1608X06N]
C78  2200pF  [CAPC1608X06N]
C79  2200pF  [CAPC1608X06N]
C80  2200pF  [CAPC1608X06N]
C81  2200pF  [CAPC1608X06N]
C82  2200pF  [CAPC1608X06N]
C83  0.1uF  [CAPC1608X06N]
D1  1PS79SB70,115  [SOD-523_L1.2-W0.8-LS1.6-RD]  (value not drawn)
D2  1PS79SB70,115  [SOD-523_L1.2-W0.8-LS1.6-RD]  (value not drawn)
D3  1PS79SB70,115  [SOD-523_L1.2-W0.8-LS1.6-RD]  (value not drawn)
D4  1PS79SB70,115  [SOD-523_L1.2-W0.8-LS1.6-RD]  (value not drawn)
D5  1PS79SB70,115  [SOD-523_L1.2-W0.8-LS1.6-RD]  (value not drawn)
D6  1PS79SB70,115  [SOD-523_L1.2-W0.8-LS1.6-RD]  (value not drawn)
D7  1PS79SB70,115  [SOD-523_L1.2-W0.8-LS1.6-RD]  (value not drawn)
D8  1PS79SB70,115  [SOD-523_L1.2-W0.8-LS1.6-RD]  (value not drawn)
R66  0  [RESC1608X05N]
R67  0  [RESC1608X05N]
R68  20  [RESC1608X05N]
R69  20  [RESC1608X05N]
R70  10.0k  [RESC1608X05N]
R71  20  [RESC1608X05N]
R72  20  [RESC1608X05N]
R73  20  [RESC1608X05N]
R74  20  [RESC1608X05N]
R75  20  [RESC1608X05N]
R76  20  [RESC1608X05N]
R77  20  [RESC1608X05N]
R78  10.0k  [RESC1608X05N]
R79  10.0k  [RESC1608X05N]
R80  10.0k  [RESC1608X05N]
R81  10.0k  [RESC1608X05N]
R82  10.0k  [RESC1608X05N]
R83#1  10.0k  [RESC1608X05N]
R84#1  10.0k  [RESC1608X05N]
R85  10.0k  [RESC1608X05N]
R86#1  10.0k  [RESC1608X05N]
R87#1  10.0k  [RESC1608X05N]
R88#1  10.0k  [RESC1608X05N]
R89#1  10.0k  [RESC1608X05N]
R90#1  10.0k  [RESC1608X05N]
R91#1  10.0k  [RESC1608X05N]
R92#1  10.0k  [RESC1608X05N]
R93#1  0  [RESC1608X05N]
R94#1  10.0k  [RESC1608X05N]
R95  20  [RESC1608X05N]
R96  20  [RESC1608X05N]
R97  20  [RESC1608X05N]
R98  20  [RESC1608X05N]
R99  20  [RESC1608X05N]
R100#1  0  [RESC1608X05N]
R101#1  0  [RESC1608X05N]
R102#1  20  [RESC1608X05N]
R103  20  [RESC1608X05N]
R104  20  [RESC1608X05N]
R105  10.0k  [RESC1608X05N]
R106  20  [RESC1608X05N]
R107  10.0k  [RESC1608X05N]
R108  10.0k  [RESC1608X05N]
R109  10.0k  [RESC1608X05N]
R110  10.0k  [RESC1608X05N]
R111  10.0k  [RESC1608X05N]
R112  10.0k  [RESC1608X05N]
R113  10.0k  [RESC1608X05N]
R114  10.0k  [RESC1608X05N]
R115  10.0k  [RESC1608X05N]
R116  10.0k  [RESC1608X05N]
R117  10.0k  [RESC1608X05N]
R118  10.0k  [RESC1608X05N]
R119  10.0k  [RESC1608X05N]
R120  10.0k  [RESC1608X05N]
R121  10.0k  [RESC1608X05N]
R122  0  [RESC1608X05N]
R123  10.0k  [RESC1608X05N]
U17  SN74AVC8T245RHLR  [RHL0024A]
U18  SN74LVC1G32DCKR  [FP-DCK0005A-IPC_A]
U19  SN74AVC8T245RHLR  [RHL0024A]
U20  SN74LVC1G32DCKR  [FP-DCK0005A-IPC_A]

### Nets
3.3A: R77.2
3.3B: R106.2
3V3: C62.1 C72.1 C73.1 C83.1 D1.1(K) D2.1(K) D3.1(K) D4.1(K) D5.1(K) D6.1(K) D7.1(K) D8.1(K) R66.2 R70.1 R92#1.1 R100#1.2 R105.1 R121.1 U17.1(VCCA) U18.5(VCC) U19.1(VCCA) U20.5(VCC)
5V: R67.2 R101#1.2
EPWM1A: R118.2 U19.3(A1)
EPWM1B: R117.2 U19.4(A2)
EPWM2A: R116.1 U19.5(A3)
EPWM2B: R115.2 U19.6(A4)
EPWM3A: R114.2 U19.7(A5)
EPWM3B: R113.2 U19.8(A6)
EPWM4A: R89#1.2 U17.3(A1)
EPWM4B: R88#1.2 U17.4(A2)
EPWM5A: R87#1.1 U17.5(A3)
EPWM5B: R86#1.2 U17.6(A4)
EPWM6A: R85.2 U17.7(A5)
EPWM6B: R84#1.2 U17.8(A6)
GND: C62.2 C63.2 C64.2 C65.2 C66.2 C67.2 C68.2 C69.2 C70.2 C71.2 C72.2 C73.2 C74.2 C75.2 C76.2 C77.2 C78.2 C79.2 C80.2 C81.2 C82.2 C83.2 R78.2 R79.2 R80.2 R81.2 R82.2 R83#1.2 R84#1.1 R85.1 R86#1.1 R87#1.2 R88#1.1 R89#1.1 R90#1.2 R91#1.2 R94#1.1 R107.2 R108.2 R109.2 R110.2 R111.2 R112.2 R113.1 R114.1 R115.1 R116.2 R117.1 R118.1 R119.2 R120.2 R123.1 U17.11(GND) U17.12(GND) U17.13(GND) U17.25(EP) U18.3(GND) U19.11(GND) U19.12(GND) U19.13(GND) U19.25(EP) U20.3(GND)
I_InA_1: C67.1 R73.2
I_InA_2: C71.1 R74.2
I_InA_3: C68.1 R75.2
I_InB_1: C78.1 R99.2
I_InB_2: C82.1 R102#1.2
I_InB_3: C79.1 R103.2
IA1: R73.1
IA2: R99.1
IB1: R74.1
IB2: R102#1.1
IC1: R75.1
IC2: R103.1
IComp1: R93#1.1
IComp2: R122.1
nEnable1: U17.22(OE_N) U18.4(Y)
nEnable2: U19.22(OE_N) U20.4(Y)
PWM_AH1: R78.1 U17.21(B1)
PWM_AH2: R107.1 U19.21(B1)
PWM_AL1: R79.1 U17.20(B2)
PWM_AL2: R108.1 U19.20(B2)
PWM_BH1: R80.1 U17.19(B3)
PWM_BH2: R109.1 U19.19(B3)
PWM_BL1: R81.1 U17.18(B4)
PWM_BL2: R110.1 U19.18(B4)
PWM_CH1: R82.1 U17.17(B5)
PWM_CH2: R111.1 U19.17(B5)
PWM_CL1: R83#1.1 U17.16(B6)
PWM_CL2: R112.1 U19.16(B6)
PWM_EN_1: R92#1.2 U18.1(A)
PWM_EN_2: R121.2 U20.1(A)
VA1: R69.1
VA2: R96.1
VA11: C69.1 D3.2(A) R69.2
VA22: C80.1 D7.2(A) R96.2
VB1: R71.1
VB2: R97.1
VB11: C66.1 D2.2(A) R71.2
VB22: C77.1 D6.2(A) R97.2
VC1: R72.1
VC2: R98.1
VC11: C70.1 D4.2(A) R72.2
VC22: C81.1 D8.2(A) R98.2
VDC: R68.1 R95.1
VDCA_In: C65.1 D1.2(A) R68.2
VDCB_In: C76.1 D5.2(A) R95.2
VREF: R76.1 R104.1
VREFA: C64.1 R76.2 R77.1
VREFB: C74.1 R104.2 R106.1
NetC63_1: C63.1 R66.1 R67.1 U17.23(VCCB) U17.24(VCCB)
NetC75_1: C75.1 R100#1.1 R101#1.1 U19.23(VCCB) U19.24(VCCB)
NetR70_2: R70.2 U17.2(DIR)
NetR90#1_1: R90#1.1 U17.9(A7)
NetR91#1_1: R91#1.1 U17.10(A8)
NetR93#1_2: R93#1.2 R94#1.2 U18.2(B)
NetR105_2: R105.2 U19.2(DIR)
NetR119_1: R119.1 U19.9(A7)
NetR120_1: R120.1 U19.10(A8)
NetR122_2: R122.2 R123.2 U20.2(B)

Not connected (* = marked no-connect by the designer): U17 14(B8) 15(B7); U19 14(B8) 15(B7)

### Notes on the sheet
- 输入PWM
- PWM使能
- 输出信号接到LCL滤波器

### Library data of the parts
C62-C83 = Cap: Capacitor; Published: 8-Jun-2000; LatestRevisionDate: 17-Jul-2002; LatestRevisionNote: Re-released for DXP Platform.; PackageReference: RAD-0.3; Publisher: Altium Limited; PackageDescription: Radial Cap, Thru-Hole; 2 Leads; 0.3 in Pin Spacing
  C62 C63 C72 C73 C75 C83: Value: 0.1uF
  C64-C71 C74 C76-C82: Value: 2200pF
D1-D8 = 1PS79SB70,115: Manufacturer: Nexperia(安世); Add into BOM: yes; Forward Voltage (Vf@If): 1V@15mA; Reverse Voltage (Vr): 70V; Average Rectified Current (Io): 70mA; Reverse Leakage Current (Ir): 10uA@70V; Symbol: 1PS79SB70,115; Device: 1PS79SB70,115; Supplier: LCSC; Manufacturer Part: 1PS79SB70,115; Supplier Part: C179321; JLCPCB Part Class: Extended Part; LCSC Part Name: 电压:70V 电流:70mA; Supplier Footprint: SOD-523; Datasheet: https://atta.szlcsc.com/upload/public/pdf/source/20180622/C194653_3DF408F362D9AF6B8137F44B9C19B985.pdf; Convert to PCB: yes
R66 R67 R100#1 R101#1 = Res: Resistor 0402; Value: K; Published: 8-Jun-2000; LatestRevisionDate: 17-Jul-2002; LatestRevisionNote: Re-released for DXP Platform.; PackageReference: AXIAL-0.4; Publisher: Altium Limited; PackageDescription: Axial Device, Thru-Hole; 2 Leads; 0.4 in Pin Spacing
R68-R82 R83#1 R84#1 R85 R86#1 R87#1 R88#1 R89#1 R90#1 R91#1 R92#1 R93#1 R94#1 R95-R99 R102#1 R103-R123 = 0603 100KΩ (1003) 1%_4: 贴片电阻; Value: 1MΩ(1%); ComponentLink1Description: 供应商链接; ComponentLink1URL: http://www.szlcsc.com/product/details_26546.html; Package: 0603; Supplier: LC; SuppliersPartNumber: C25803
U17 U19 = SN74AVC8T245RHLR: No Description Available; Mfr_Name: Texas Instruments; CompType: IC; Type: DEV; RefDes: RefDes; Copyright: Copyright (C) 2024 Ultra Librarian. All rights reserved.; Manufacturer_Part_Number: SN74AVC8T245RHLR; PartNumber: SN74AVC8T245RHL; PackageReference: RHL0024A; MountType: SMT; RoHS: Y; Manufacturer: Texas Instruments
U18 U20 = CMP-0859-00376-4: IC GATE OR 1CH 2-INP SC70-5; Turn-On Delay Time: 4.5ns; Schmitt Trigger Input: No; Number of Bits: 1; High Level Output Current: -32mA; Max Supply Voltage: 5.5V; Propagation Delay: 4ns; Max Output Current: 32mA; Min Supply Voltage: 1.65V; Number of Input Lines: 2; Quiescent Current: 10uA; Case/Package: SC; Weight: 8.8E-05oz; Logic Function: OR; Package Quantity: 1; Packaging: Tape and Reel; Mount: Surface Mount; Max Operating Temperature: 125°C; Output Current: 32mA; Length: 2mm; Contact Plating: Gold; Number of Output Lines: 1; Height: 0.9mm; Number of Pins: 5; Width: 1.25mm; REACH SVHC: No SVHC; Number of Circuits: 1; Radiation Hardening: No; Number of Elements: 1; Low Level Output Current: 32mA; Number of Outputs: 1; Min Operating Temperature: -40°C; Number of Inputs: 2; Lead Free: Lead Free; Termination: SMD/SMT; Number of Gates: 1

## Sheet power.SchDoc
size A3
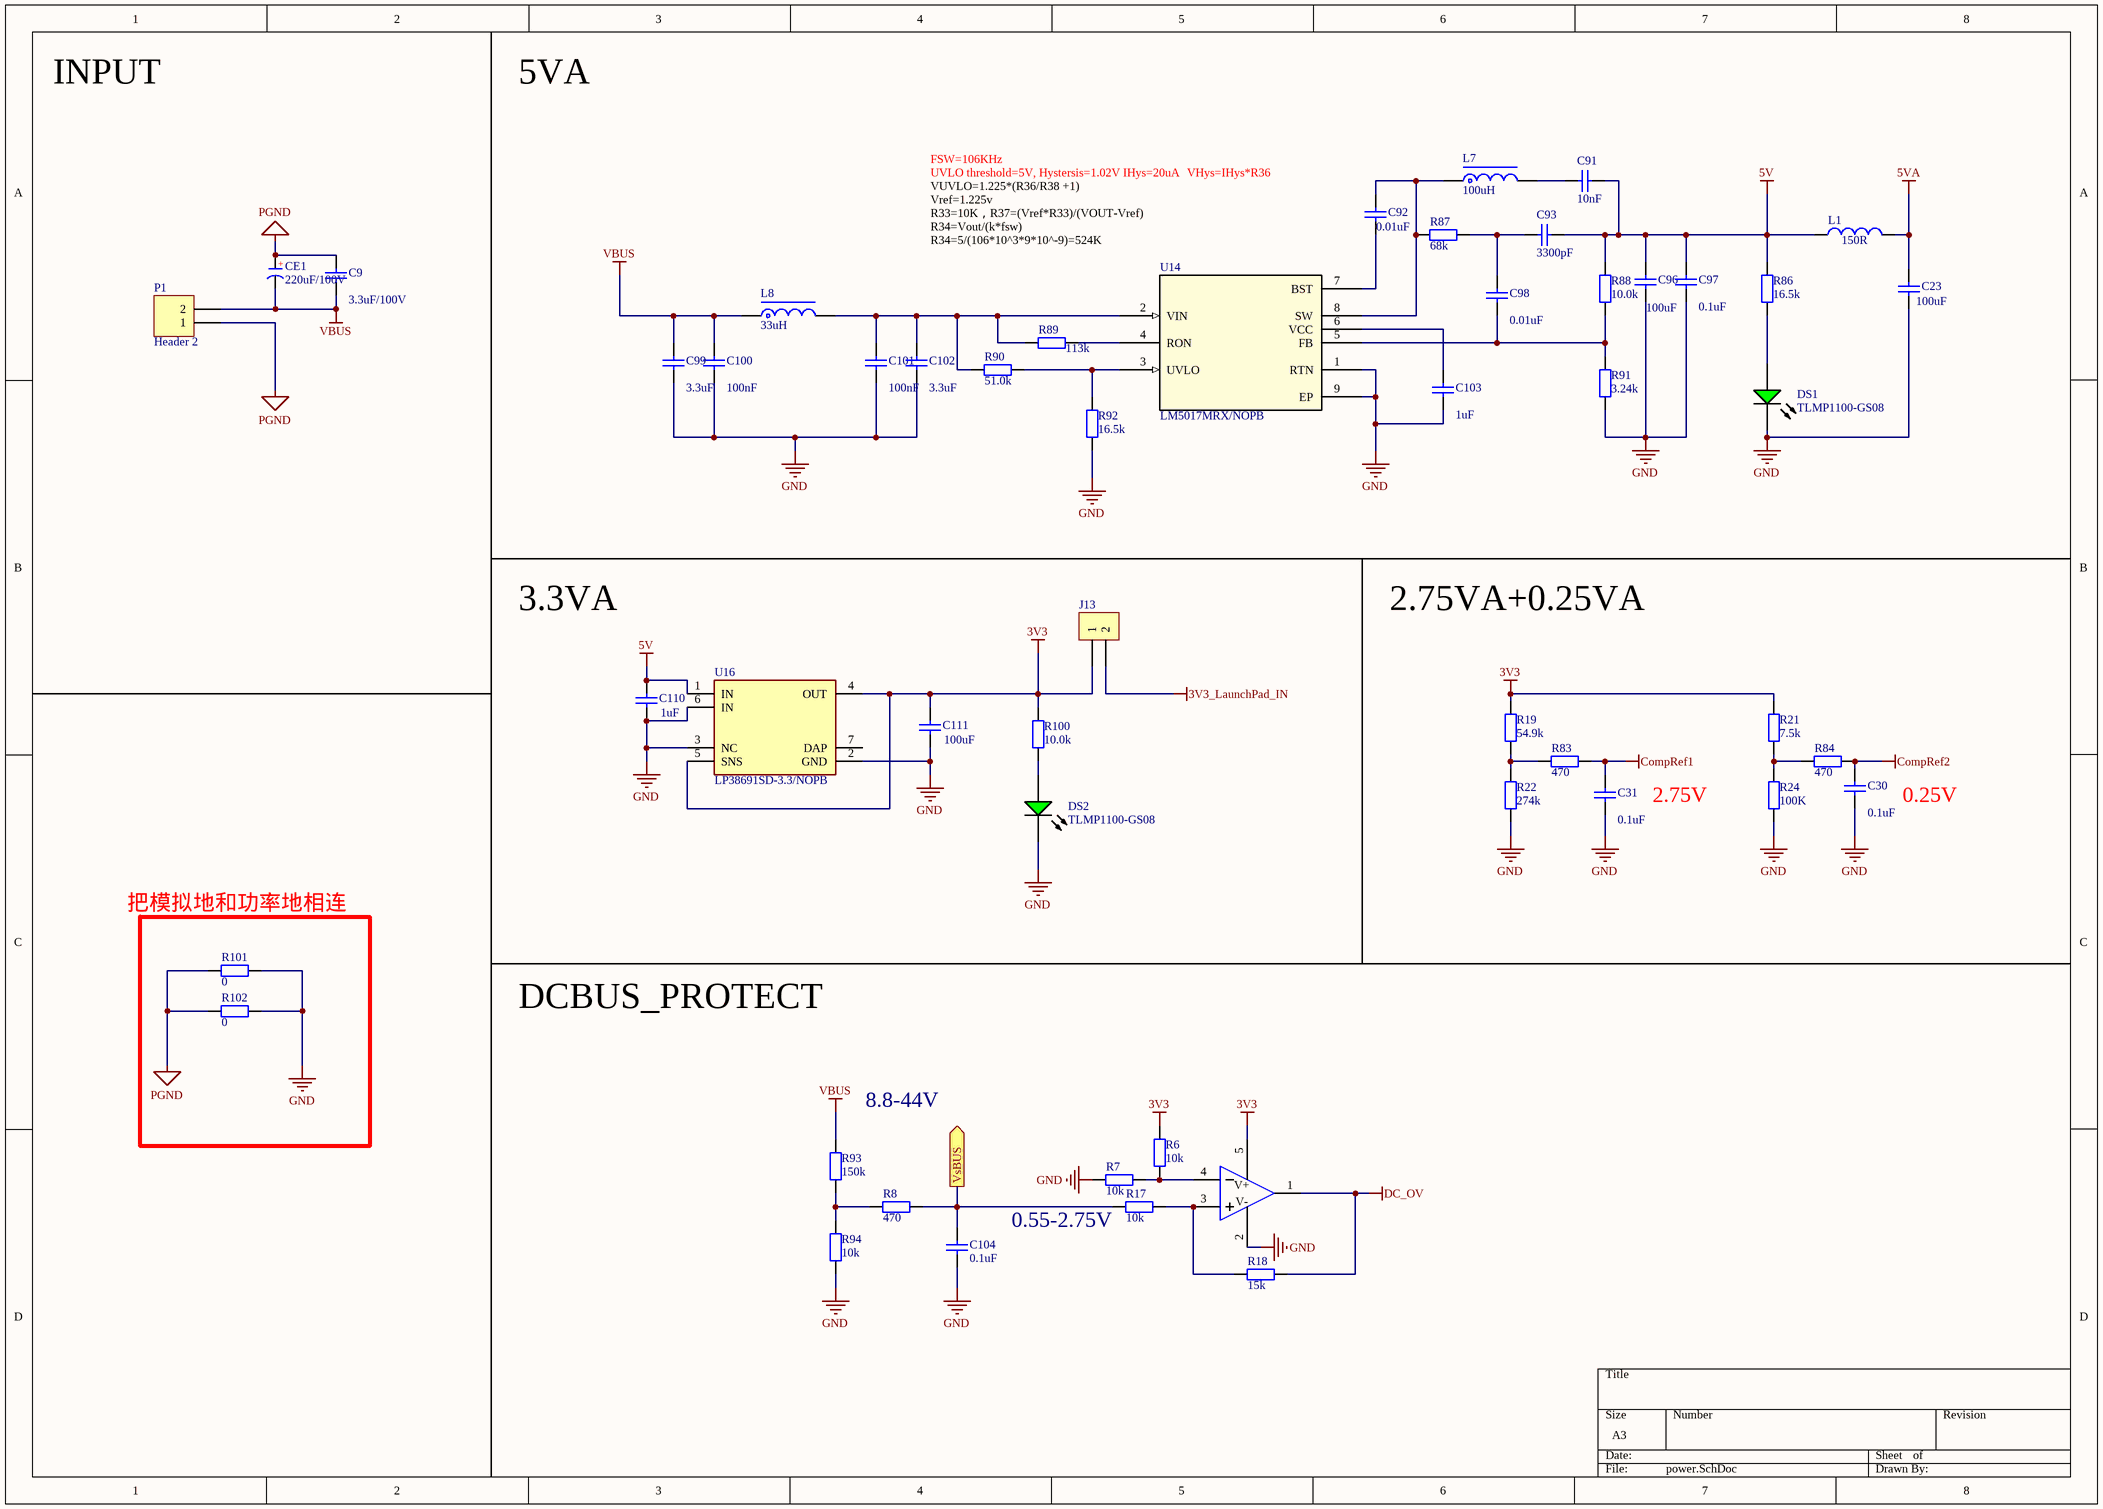
[diagram p9: power.SchDoc]

### Parts
(Parts that share a designator on the sheet are numbered #1, #2 ... from top to bottom, then left to right.)
C9#2  3.3uF/100V  [CAPC1608X06N]
C23  100uF  [CAPC1608X06N]
C30  0.1uF  [CAPC1608X06N]
C31  0.1uF  [CAPC1608X06N]
C91  10nF  [CAPC1608X06N]
C92  0.01uF  [CAPC1608X06N]
C93  3300pF  [CAPC1608X06N]
C96  100uF  [CAPC1608X06N]
C97  0.1uF  [CAPC1608X06N]
C98  0.01uF  [CAPC1608X06N]
C99  3.3uF  [CAPC1608X06N]
C100  100nF  [CAPC1608X06N]
C101  100nF  [CAPC1608X06N]
C102  3.3uF  [CAPC1608X06N]
C103  1uF  [CAPC1608X06N]
C104  0.1uF  [CAPC1608X06N]
C110  1uF  [CAPC1608X06N]
C111  100uF  [CAPC1608X06N]
CE1  220uF/100V  [CAP 5.0*12.5*20]
DS1  TLMP1100-GS08  [VISH-TLMX1100_V]
DS2  TLMP1100-GS08  [VISH-TLMX1100_V]
J13#2  CON2  [DG1282-5.0]  (value not drawn)
L1#2  value 150R  [IND-SMD_L5.5-W5.2]  (hidden comment: Inductor)
L7  100uH  [NR4018]
L8  33uH  [NR2520]
P1  Header 2  [HDR1X2]
R6#2  10k  [RESC1608X05N]
R7#2  10k  [RESC1608X05N]
R8#2  470  [RESC1608X05N]
R17  10k  [RESC1608X05N]
R18  15k  [RESC1608X05N]
R19  54.9k  [RESC1608X05N]
R21  7.5k  [RESC1608X05N]
R22  274k  [RESC1608X05N]
R24  100K  [RESC1608X05N]
R83#2  470  [RESC1608X05N]
R84#2  470  [RESC1608X05N]
R86#2  16.5k  [RESC1608X05N]
R87#2  68k  [RESC1608X05N]
R88#2  10.0k  [RESC1608X05N]
R89#2  113k  [RESC1608X05N]
R90#2  51.0k  [RESC1608X05N]
R91#2  3.24k  [RESC1608X05N]
R92#2  16.5k  [RESC1608X05N]
R93#2  150k  [RESC1608X05N]
R94#2  10k  [RESC1608X05N]
R100#2  10.0k  [RESC1608X05N]
R101#2  0  [RESC1608X05N]
R102#2  0  [RESC1608X05N]
U6  TLV3201AIDBVR  [SOT-23-5_L3.0-W1.7-P0.95-LS2.8-BR]  (value not drawn)
U14  LM5017MRX/NOPB  [DDA8_3P1X2P41]
U16  LP38691SD-3.3/NOPB  [FP-NGG0006A-MFG]

### Ports
VsBUS (out)

### Nets
3V3: C111.2 J13#2.1 R6#2.1 R19.2 R21.2 R100#2.2 U6.5(VCC) U16.4(OUT) U16.5(SNS)
3V3_LaunchPad_IN: J13#2.2
5V: C91.2 C93.1 C96.2 C97.2 C110.2 L1#2.1 R86#2.2 R88#2.2 U16.1(IN)
5VA: C23.2 L1#2.2
CompRef1: C31.2 R83#2.1
CompRef2: C30.2 R84#2.1
DC_OV: R18.1 U6.1(OUT)
GND: C23.1 C30.1 C31.1 C96.1 C97.1 C99.2 C100.2 C101.2 C102.1 C103.1 C104.2 C110.1 C111.1 DS1.2(K) DS2.2(K) R7#2.2 R22.1 R24.1 R91#2.1 R92#2.1 R94#2.1 R101#2.1 R102#2.1 U6.2(GND) U14.1(RTN) U14.9(EP) U16.2(GND) U16.3(NC) U16.6(IN)
PGND: C9#2.2 CE1.1(A) P1.1 R101#2.2 R102#2.2
VBUS: C9#2.1 C99.1 C100.1 CE1.2(K) L8.1 P1.2 R93#2.2
NetC91_1: C91.1 L7.2
NetC92_1: C92.1 U14.7(BST)
NetC92_2: C92.2 L7.1 R87#2.2 U14.8(SW)
NetC93_2: C93.2 C98.2 R87#2.1
NetC98_1: C98.1 R88#2.1 R91#2.2 U14.5(FB)
NetC101_1: C101.1 C102.2 L8.2 R89#2.1 R90#2.1 U14.2(VIN)
NetC103_2: C103.2 U14.6(VCC)
NetC104_1: C104.1 R8#2.1 R17.2 ; port VsBUS
NetDS1_1: DS1.1(A) R86#2.1
NetDS2_1: DS2.1(A) R100#2.1
NetR6#2_2: R6#2.2 R7#2.1 U6.4(IN-)
NetR8#2_2: R8#2.2 R93#2.1 R94#2.2
NetR17_1: R17.1 R18.2 U6.3(IN+)
NetR19_1: R19.1 R22.2 R83#2.2
NetR21_1: R21.1 R24.2 R84#2.2
NetR89#2_2: R89#2.2 U14.4(RON)
NetR90#2_2: R90#2.2 R92#2.2 U14.3(UVLO)

Not connected (* = marked no-connect by the designer): U16 7(DAP)

### Notes on the sheet
- INPUT
- 5VA
- FSW=106KHz
- UVLO threshold=5V, Hystersis=1.02V IHys=20uA
- VHys=IHys*R36
- Vref=1.225v
- R33=10K，R37=(Vref*R33)/(VOUT-Vref)
- R34=Vout/(k*fsw)
- R34=5/(106*10^3*9*10^-9)=524K
- VUVLO=1.225*(R36/R38 +1)
- 3.3VA
- 2.75VA+0.25VA
- 2.75V
- 0.25V
- 把模拟地和功率地相连
- DCBUS_PROTECT
- (near R93#2) 8.8-44V
- (near R17) 0.55-2.75V
- (in symbol CE) +
- (in symbol TLV3201AIDBVR) V+; V-

### Library data of the parts
C9#2 C23 C30 C31 C91-C93 C96-C104 C110 C111 = Cap: Capacitor; Published: 8-Jun-2000; LatestRevisionDate: 17-Jul-2002; LatestRevisionNote: Re-released for DXP Platform.; PackageReference: RAD-0.3; Publisher: Altium Limited; PackageDescription: Radial Cap, Thru-Hole; 2 Leads; 0.3 in Pin Spacing
  C9#2: Value: 3.3uF/100V
  C23 C96 C111: Value: 100uF
  C30 C31 C97 C104: Value: 0.1uF
  C91: Value: 10nF
  C92 C98: Value: 0.01uF
  C93: Value: 3300pF
  C99 C102: Value: 3.3uF
  C100 C101: Value: 100nF
  C103 C110: Value: 1uF
CE1 = CE: 直插电解电容; 淘宝ID: 封装库来自淘宝 ID：黄晶宝石; BOM名称: 直插电解电容; 联系售后: https://shop463601444.taobao.com
DS1 DS2 = CMP-1666-00027-1_1: LED, RED, 2.1 V, -40 to 100 degC, 2-Pin SMD (0603), RoHS, Tape and Reel; Type (Capacitors): C0G; Resistance: 100000000000 Ohm; Capacitance: 12 pF; Voltage Rating: 50 V; Tolerance: 5%; Min Operating Temperature: -55degC; REACH SVHC: No SVHC; ComponentLink2Description: Datasheet; ComponentLink1URL: http://www.vishay.com/; Width: 0.8 mm; Package Quantity: 4000; PackageReference: TLMX1100; ComponentLink2URL: http://www.vishay.com/docs/83173/tlmb1100.pdf; Case/Package: 0603; Case Code (Metric): 1608; Packaging: Tape and Reel; Pins: 2; ComponentLink1Description: Manufacturer URL; Max Operating Temperature: 125degC; Height: 0.8 mm; Length: 1.6 mm; Mount: Surface Mount; PackageDescription: 2-Pin Surface Mount Device, Body 1.6 x 0.8 mm; DatasheetVersion: Rev. 2.7, 03/2016; Case Code (Imperial): 0603; Voltage Rating (DC): 50 V; RoHSCompliant: True; Radiation Hardening: No
L1#2 = Inductor: Code_IEC: 1005; Published: 8-Jun-2000; LatestRevisionDate: 29-May-2009; LatestRevisionNote: IPC-7351 Footprint Added.; PackageReference: 0402-A; Publisher: Altium Limited; Code_JEITA: 0402; PackageDescription: Chip Inductor
L7 L8 = L-NR: NR磁胶电感; 版权归属: 来自淘宝 ID：黄晶宝石; BOM名称: NR磁胶电感; 联系售后: https://shop463601444.taobao.com
P1 = Header 2: Header, 2-Pin; LatestRevisionDate: 17-Jul-2002; LatestRevisionNote: Re-released for DXP Platform.; Publisher: Altium Limited
R6#2 R7#2 R8#2 R17-R19 R21 R22 R24 R83#2 R84#2 R86#2 R87#2 R88#2 R89#2 R90#2 R91#2 R92#2 R93#2 R94#2 R100#2 R101#2 R102#2 = 0603 100KΩ (1003) 1%_4: 贴片电阻; Value: 1MΩ(1%); ComponentLink1Description: 供应商链接; ComponentLink1URL: http://www.szlcsc.com/product/details_26546.html; Package: 0603; Supplier: LC; SuppliersPartNumber: C25803
U6 = TLV3201AIDBVR: Manufacturer: TI(德州仪器); Add into BOM: yes; Input Offset Voltage (Vos): 1mV; Input Bias Current (Ib): 5nA; Propagation Delay Time: 40ns; Input Hysteresis Voltage (Vhys): 1.2mV; Common Mode Rejection Ratio (CMRR): 70dB; Supply Voltage: 2.7V~5.5V; Output Type: 推挽; Supply Current: 40uA; Symbol: TLV3201AIDBVR; Device: TLV3201AIDBVR; LCSC Part Name: TLV3201AIDBVR; Supplier Part: C105188; Manufacturer Part: TLV3201AIDBVR; Supplier Footprint: SOT-23-5; JLCPCB Part Class: Extended Part; Datasheet: https://www.ti.com/cn/lit/gpn/tlv3201; Supplier: LCSC; Convert to PCB: yes; Output Mode: -; Rail-to-Rail: -; Operating Temperature: -40℃~+125℃
U14 = LM5017MRXNOPB: No Description Available; Mfr_Name: Texas Instruments; Copyright: Copyright (C) 2024 Ultra Librarian. All rights reserved.; Manufacturer_Part_Number: LM5017MRX/NOPB; RefDes: RefDes; Type: DEV
U16 = CMP-0062-01590-5: IC REG LINEAR 3.3V 500MA 6WSON; Min Input Voltage: 2.7V; Number of Regulators: 1; Polarity: Positive; Dropout Voltage: 330mV; Output Type: Fixed; Output Voltage Accuracy: 2%; Max Input Voltage: 10V; Quiescent Current: 100uA; Max Output Current: 500mA; Output Current: 500mA; Package Quantity: 1000; Nominal Output Voltage: 3.3V; Number of Pins: 6; Number of Outputs: 1; Length: 3mm; Output Voltage: 3.3V; Height: 0.86mm; REACH SVHC: No SVHC; Accuracy: 2%; Lead Free: Lead Free; Mount: Surface Mount; Packaging: Tape and Reel; Contact Plating: Tin; Max Operating Temperature: 125°C; Min Operating Temperature: -40°C; Radiation Hardening: No; Width: 3mm

## Sheet 3Phase Inverter1.SchDoc
size A2
Used 2 times, as channels U_3Phase Inverter1, U_3Phase Inverter2. Parts and nets are listed once, with the designators drawn on the sheet.
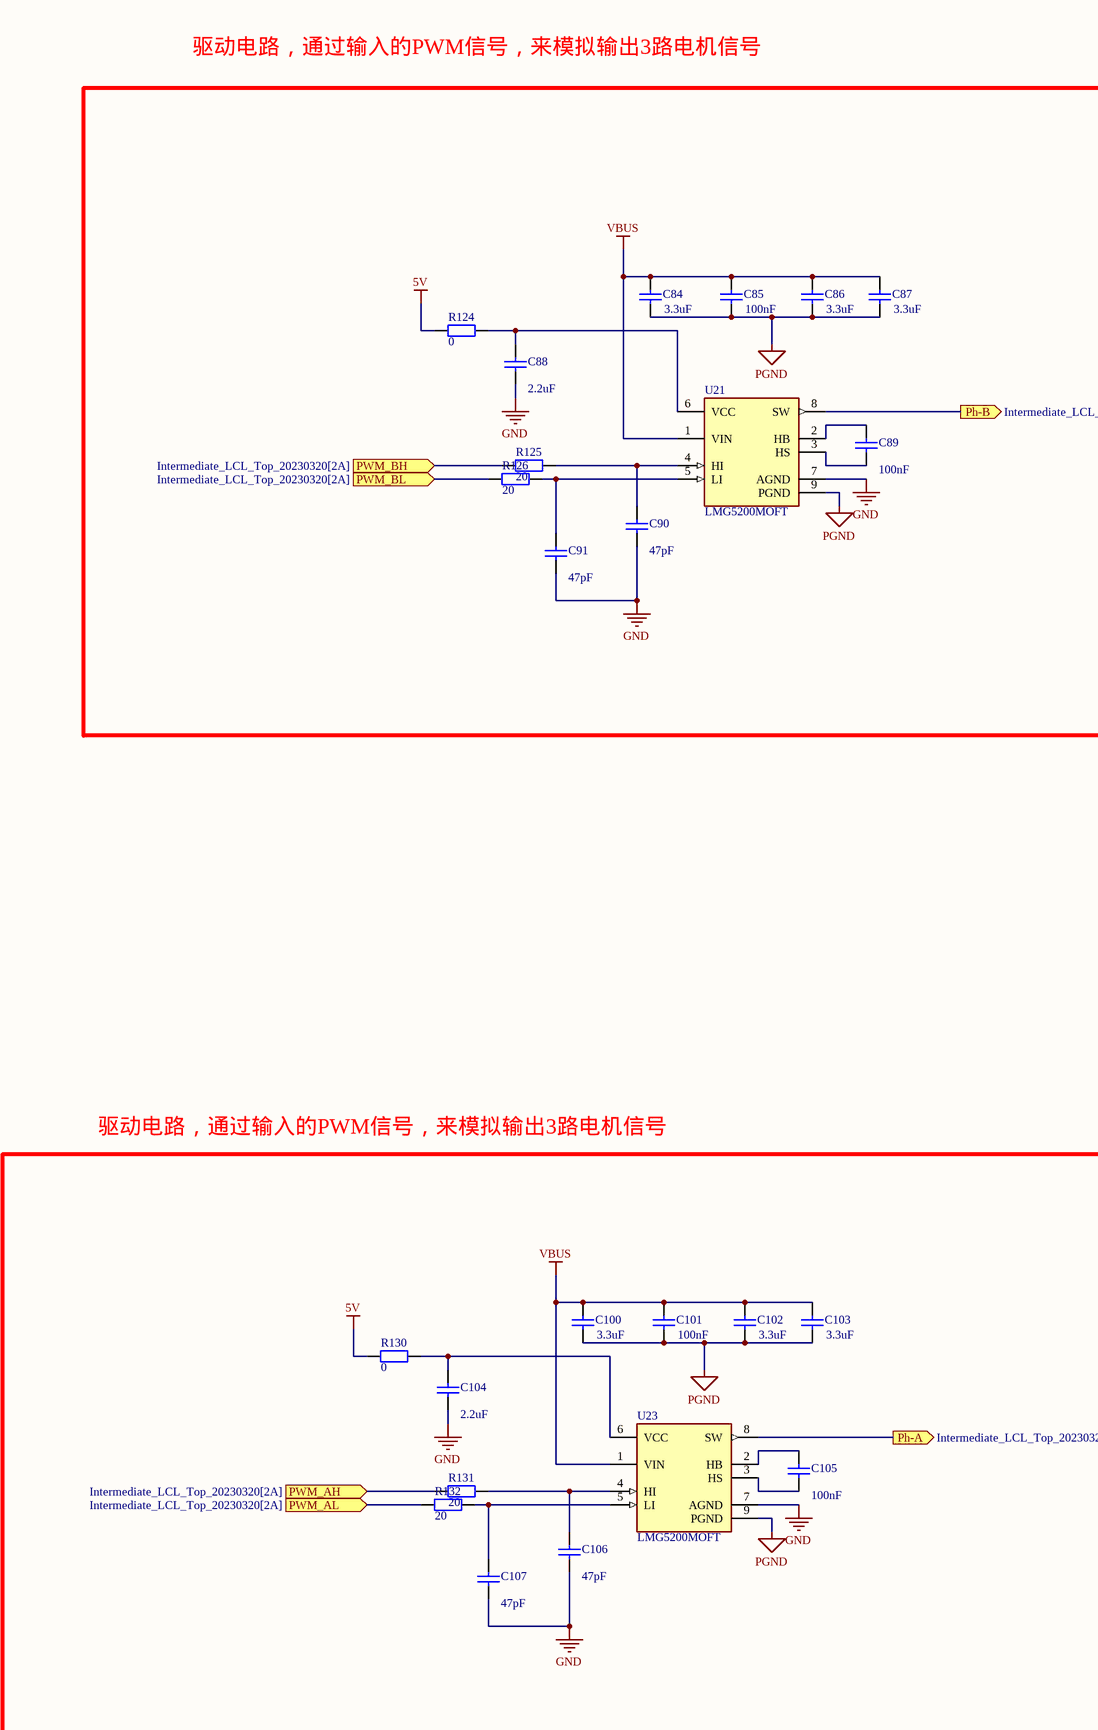
[diagram p10: 3Phase Inverter1.SchDoc, left]
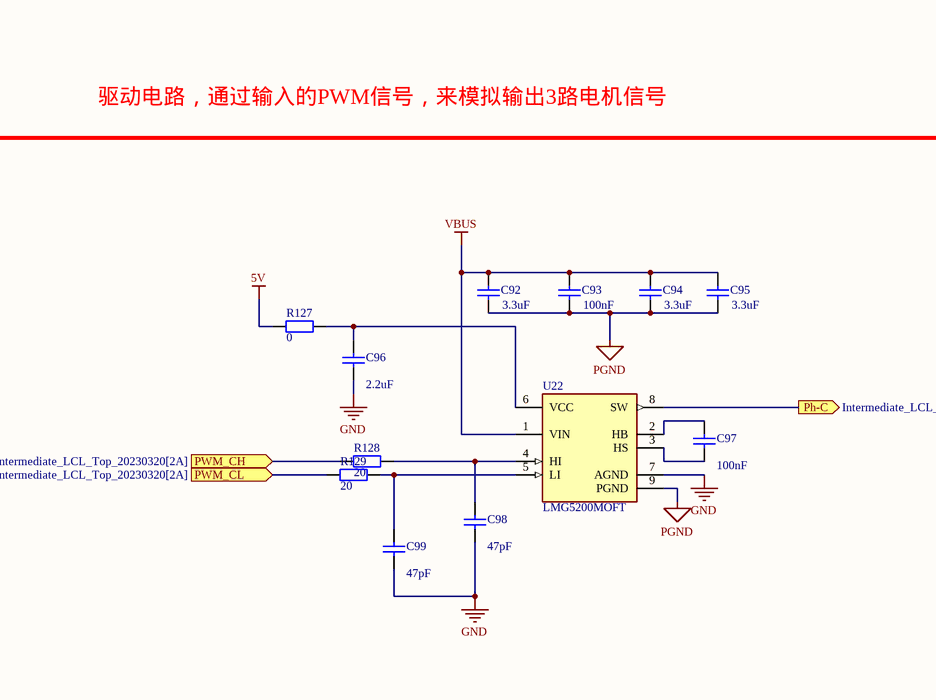
[diagram p11: 3Phase Inverter1.SchDoc, right]

### Parts
C84  3.3uF  [CAPC1608X06N]
C85  100nF  [CAPC1608X06N]
C86  3.3uF  [CAPC1608X06N]
C87  3.3uF  [CAPC1608X06N]
C88  2.2uF  [CAPC1608X06N]
C89  100nF  [CAPC1608X06N]
C90  47pF  [CAPC1608X06N]
C91  47pF  [CAPC1608X06N]
C92  3.3uF  [CAPC1608X06N]
C93  100nF  [CAPC1608X06N]
C94  3.3uF  [CAPC1608X06N]
C95  3.3uF  [CAPC1608X06N]
C96  2.2uF  [CAPC1608X06N]
C97  100nF  [CAPC1608X06N]
C98  47pF  [CAPC1608X06N]
C99  47pF  [CAPC1608X06N]
C100  3.3uF  [CAPC1608X06N]
C101  100nF  [CAPC1608X06N]
C102  3.3uF  [CAPC1608X06N]
C103  3.3uF  [CAPC1608X06N]
C104  2.2uF  [CAPC1608X06N]
C105  100nF  [CAPC1608X06N]
C106  47pF  [CAPC1608X06N]
C107  47pF  [CAPC1608X06N]
R124  0  [RESC1608X05N]
R125  20  [RESC1608X05N]
R126  20  [RESC1608X05N]
R127  0  [RESC1608X05N]
R128  20  [RESC1608X05N]
R129  20  [RESC1608X05N]
R130  0  [RESC1608X05N]
R131  20  [RESC1608X05N]
R132  20  [RESC1608X05N]
U21  LMG5200MOFT  [FP-MOF0009A-MFG]
U22  LMG5200MOFT  [FP-MOF0009A-MFG]
U23  LMG5200MOFT  [FP-MOF0009A-MFG]

### Ports
Ph-A (out, see Intermediate_LCL_Top_20230320[3A], 3Phase Inverter2[1A]), Ph-B (out, see Intermediate_LCL_Top_20230320[3A], 3Phase Inverter2[5B]), Ph-C (out, see Intermediate_LCL_Top_20230320[3A], 3Phase Inverter2[1C]), PWM_AH (in, see Intermediate_LCL_Top_20230320[2A]), PWM_AL (in, see Intermediate_LCL_Top_20230320[2A]), PWM_BH (in, see Intermediate_LCL_Top_20230320[2A]), PWM_BL (in, see Intermediate_LCL_Top_20230320[2A]), PWM_CH (in, see Intermediate_LCL_Top_20230320[2A]), PWM_CL (in, see Intermediate_LCL_Top_20230320[2A])

### Nets
5V: R124.2 R127.2 R130.2
GND: C88.1 C90.2 C91.2 C96.1 C98.2 C99.2 C104.1 C106.2 C107.2 U21.7(AGND) U22.7(AGND) U23.7(AGND)
PGND: C84.1 C85.2 C86.1 C87.1 C92.1 C93.2 C94.1 C95.1 C100.1 C101.2 C102.1 C103.1 U21.9(PGND) U22.9(PGND) U23.9(PGND)
VBUS: C84.2 C85.1 C86.2 C87.2 C92.2 C93.1 C94.2 C95.2 C100.2 C101.1 C102.2 C103.2 U21.1(VIN) U22.1(VIN) U23.1(VIN)
Ph-A: U23.8(SW) ; port Ph-A
Ph-B: U21.8(SW) ; port Ph-B
Ph-C: U22.8(SW) ; port Ph-C
PWM_AH: R131.2 ; port PWM_AH
PWM_AL: R132.2 ; port PWM_AL
PWM_BH: R125.2 ; port PWM_BH
PWM_BL: R126.2 ; port PWM_BL
PWM_CH: R128.2 ; port PWM_CH
PWM_CL: R129.2 ; port PWM_CL
NetC88_2: C88.2 R124.1 U21.6(VCC)
NetC89_1: C89.1 U21.2(HB)
NetC89_2: C89.2 U21.3(HS)
NetC90_1: C90.1 R125.1 U21.4(HI)
NetC91_1: C91.1 R126.1 U21.5(LI)
NetC96_2: C96.2 R127.1 U22.6(VCC)
NetC97_1: C97.1 U22.2(HB)
NetC97_2: C97.2 U22.3(HS)
NetC98_1: C98.1 R128.1 U22.4(HI)
NetC99_1: C99.1 R129.1 U22.5(LI)
NetC104_2: C104.2 R130.1 U23.6(VCC)
NetC105_1: C105.1 U23.2(HB)
NetC105_2: C105.2 U23.3(HS)
NetC106_1: C106.1 R131.1 U23.4(HI)
NetC107_1: C107.1 R132.1 U23.5(LI)

### Channels
U_3Phase Inverter1: designators end in _1; ports Ph-A=Ph-A1 Ph-B=Ph-B1 Ph-C=Ph-C1 PWM_AH=PWM_AH1 PWM_AL=PWM_AL1 PWM_BH=PWM_BH1 PWM_BL=PWM_BL1 PWM_CH=PWM_CH1 PWM_CL=PWM_CL1
U_3Phase Inverter2: designators end in _2; ports Ph-A=Ph-A2 Ph-B=Ph-B2 Ph-C=Ph-C2 PWM_AH=PWM_AH2 PWM_AL=PWM_AL2 PWM_BH=PWM_BH2 PWM_BL=PWM_BL2 PWM_CH=PWM_CH2 PWM_CL=PWM_CL2

### Notes on the sheet
- 驱动电路，通过输入的PWM信号，来模拟输出3路电机信号

### Library data of the parts
C84-C107 = Cap: Capacitor; Published: 8-Jun-2000; LatestRevisionDate: 17-Jul-2002; LatestRevisionNote: Re-released for DXP Platform.; PackageReference: RAD-0.3; Publisher: Altium Limited; PackageDescription: Radial Cap, Thru-Hole; 2 Leads; 0.3 in Pin Spacing
  C84 C86 C87 C92 C94 C95 C100 C102 C103: Value: 3.3uF
  C85 C89 C93 C97 C101 C105: Value: 100nF
  C88 C96 C104: Value: 2.2uF
  C90 C91 C98 C99 C106 C107: Value: 47pF
R124-R132 = 0603 100KΩ (1003) 1%_4: 贴片电阻; Value: 1MΩ(1%); ComponentLink1Description: 供应商链接; ComponentLink1URL: http://www.szlcsc.com/product/details_26546.html; Package: 0603; Supplier: LC; SuppliersPartNumber: C25803
U21-U23 = CMP-04912-000022-2: None; Output Current per Channel: 10A; Interface: Logic; Min Operating Temperature: -40°C; Mount: Surface Mount; Case/Package: QFN; RoHS Compliant: Yes; Packaging: Cut Tape; Max Operating Temperature: 125°C; Number of Pins: 9

## Sheet 3Phase Inverter2.SchDoc
size A3
Used 2 times, as channels U_1231, U_1232. Parts and nets are listed once, with the designators drawn on the sheet.
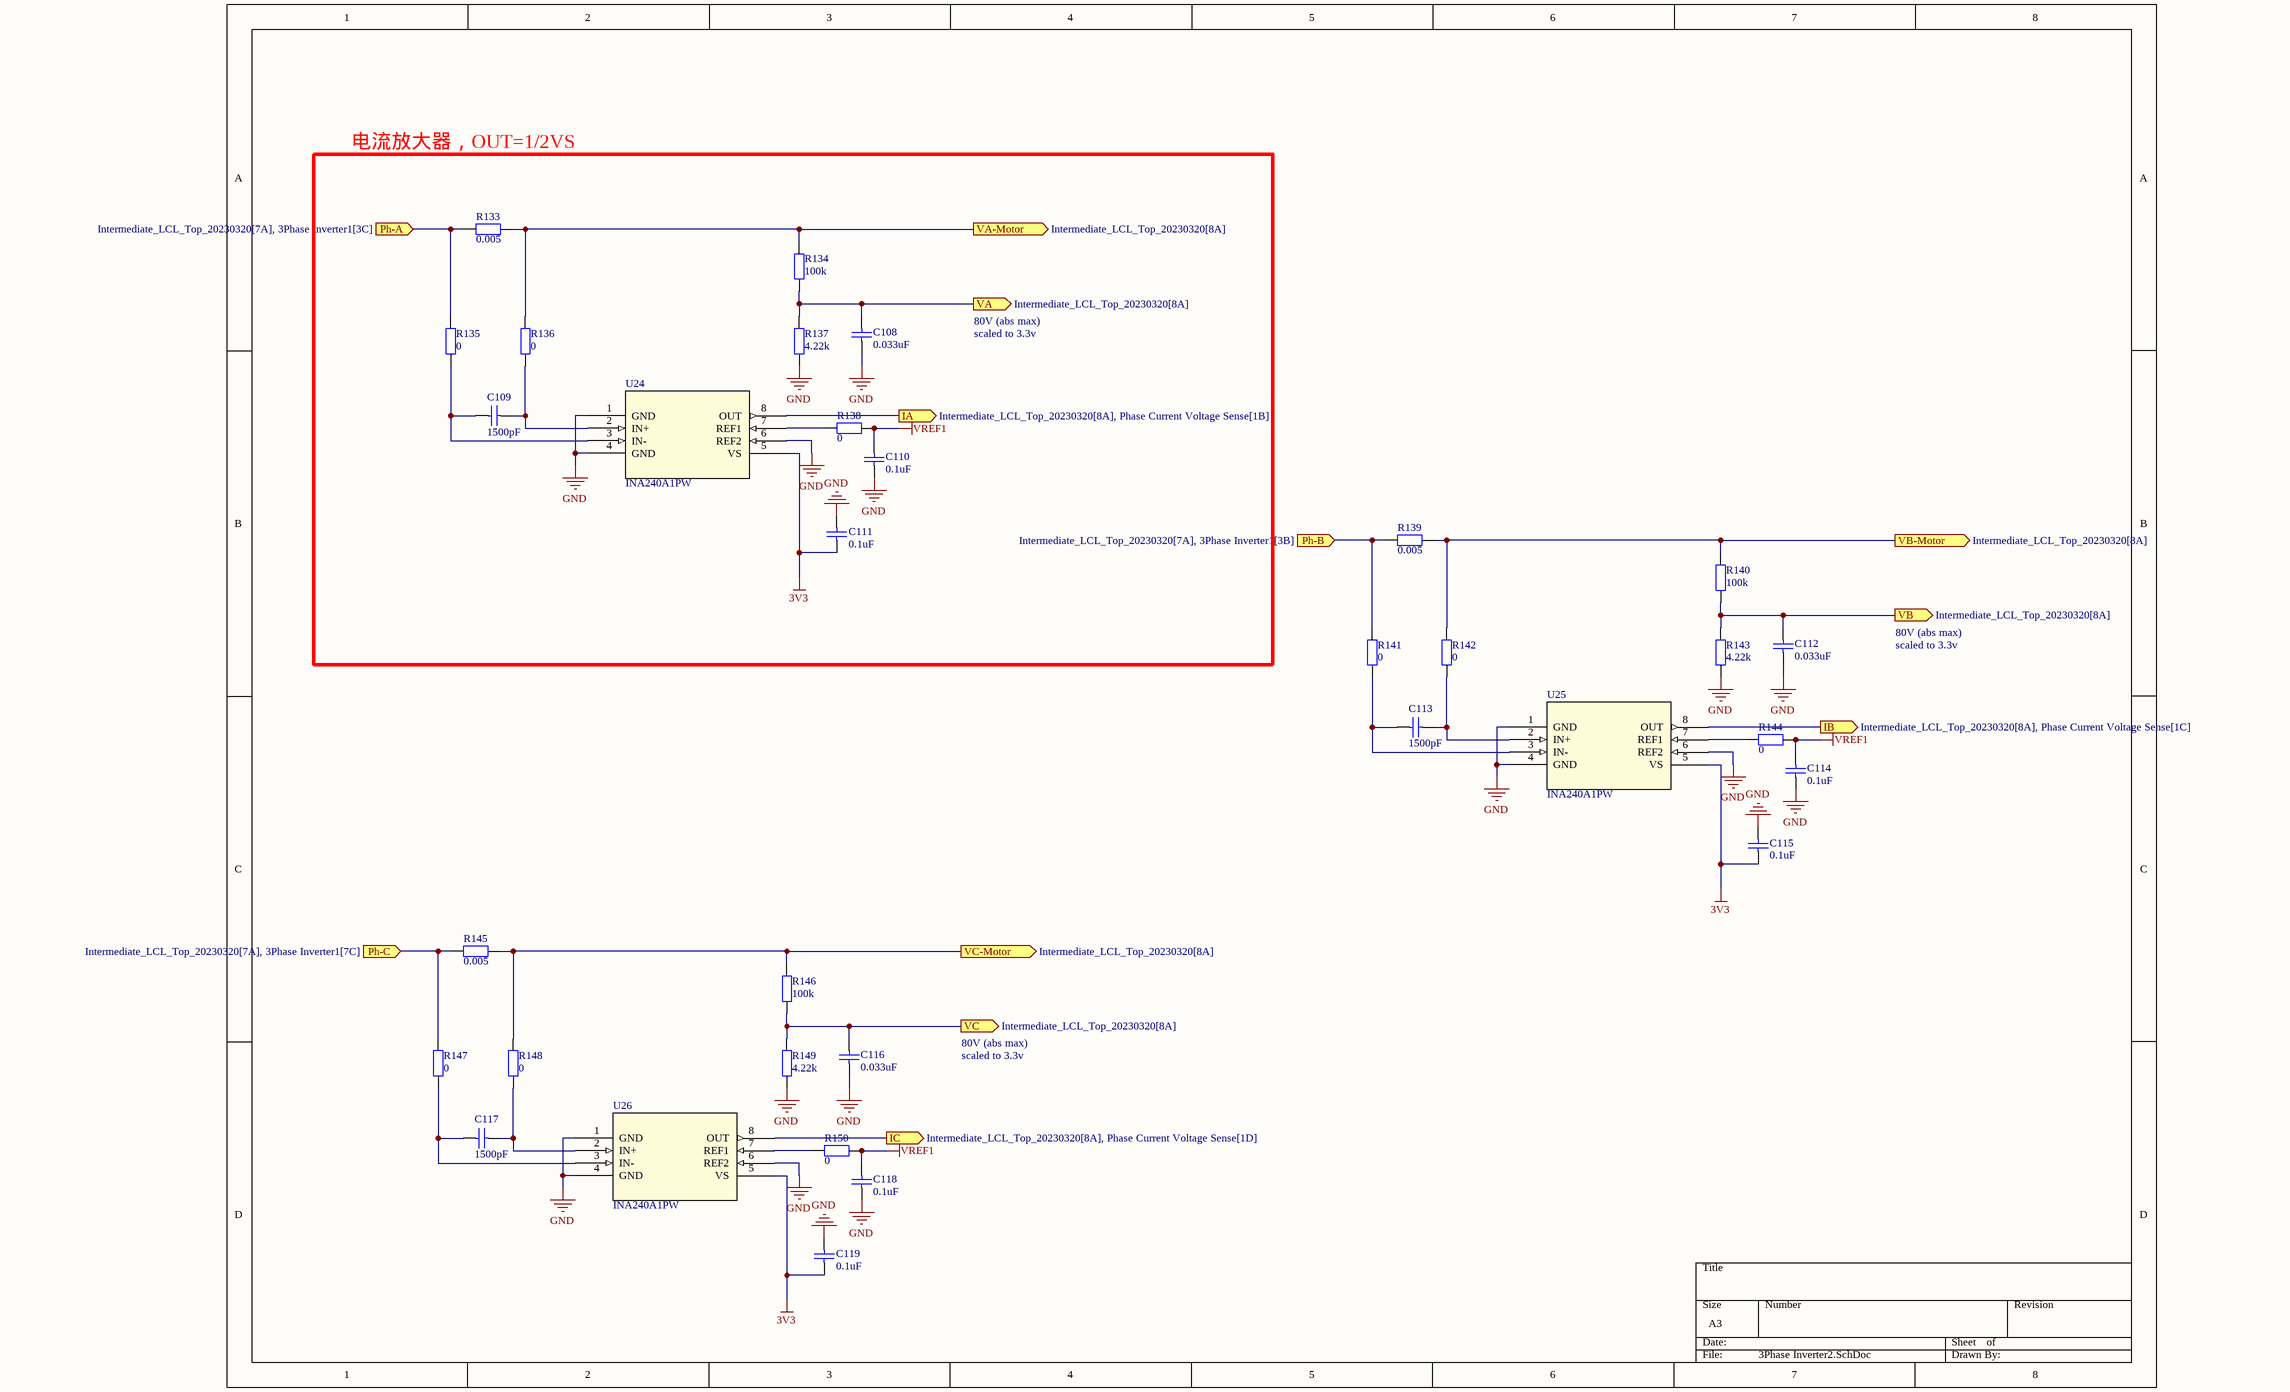
[diagram p12: 3Phase Inverter2.SchDoc]

### Parts
C108  0.033uF  [CAPC1608X06N]
C109  1500pF  [CAPC1608X06N]
C110  0.1uF  [CAPC1608X06N]
C111  0.1uF  [CAPC1608X06N]
C112  0.033uF  [CAPC1608X06N]
C113  1500pF  [CAPC1608X06N]
C114  0.1uF  [CAPC1608X06N]
C115  0.1uF  [CAPC1608X06N]
C116  0.033uF  [CAPC1608X06N]
C117  1500pF  [CAPC1608X06N]
C118  0.1uF  [CAPC1608X06N]
C119  0.1uF  [CAPC1608X06N]
R133  0.005  [RESC1608X05N]
R134  100k  [RESC1608X05N]
R135  0  [RESC1608X05N]
R136  0  [RESC1608X05N]
R137  4.22k  [RESC1608X05N]
R138  0  [RESC1608X05N]
R139  0.005  [RESC1608X05N]
R140  100k  [RESC1608X05N]
R141  0  [RESC1608X05N]
R142  0  [RESC1608X05N]
R143  4.22k  [RESC1608X05N]
R144  0  [RESC1608X05N]
R145  0.005  [RESC1608X05N]
R146  100k  [RESC1608X05N]
R147  0  [RESC1608X05N]
R148  0  [RESC1608X05N]
R149  4.22k  [RESC1608X05N]
R150  0  [RESC1608X05N]
U24  INA240A1PW  [PW0008A_N_TEX]
U25  INA240A1PW  [PW0008A_N_TEX]
U26  INA240A1PW  [PW0008A_N_TEX]

### Ports
IA (out, see Intermediate_LCL_Top_20230320[8A], Phase Current Voltage Sense[1B]), IB (out, see Intermediate_LCL_Top_20230320[8A], Phase Current Voltage Sense[1C]), IC (out, see Intermediate_LCL_Top_20230320[8A], Phase Current Voltage Sense[1D]), Ph-A (in, see Intermediate_LCL_Top_20230320[7A], 3Phase Inverter1[3C]), Ph-B (in, see Intermediate_LCL_Top_20230320[7A], 3Phase Inverter1[3B]), Ph-C (in, see Intermediate_LCL_Top_20230320[7A], 3Phase Inverter1[7C]), VA (out, see Intermediate_LCL_Top_20230320[8A]), VA-Motor (out, see Intermediate_LCL_Top_20230320[8A]), VB (out, see Intermediate_LCL_Top_20230320[8A]), VB-Motor (out, see Intermediate_LCL_Top_20230320[8A]), VC (out, see Intermediate_LCL_Top_20230320[8A]), VC-Motor (out, see Intermediate_LCL_Top_20230320[8A])

### Nets
3V3: C111.2 C115.2 C119.2 U24.5(VS) U25.5(VS) U26.5(VS)
GND: C108.2 C110.2 C111.1 C112.2 C114.2 C115.1 C116.2 C118.2 C119.1 R137.1 R143.1 R149.1 U24.1(GND) U24.4(GND) U24.6(REF2) U25.1(GND) U25.4(GND) U25.6(REF2) U26.1(GND) U26.4(GND) U26.6(REF2)
VREF1: C110.1 C114.1 C118.1 R138.1 R144.1 R150.1
IA: U24.8(OUT) ; port IA
IB: U25.8(OUT) ; port IB
IC: U26.8(OUT) ; port IC
Ph-A: R133.2 R135.1 ; port Ph-A
Ph-B: R139.2 R141.1 ; port Ph-B
Ph-C: R145.2 R147.1 ; port Ph-C
VA: C108.1 R134.1 R137.2 ; port VA
VA-Motor: R133.1 R134.2 R136.1 ; port VA-Motor
VB: C112.1 R140.1 R143.2 ; port VB
VB-Motor: R139.1 R140.2 R142.1 ; port VB-Motor
VC: C116.1 R146.1 R149.2 ; port VC
VC-Motor: R145.1 R146.2 R148.1 ; port VC-Motor
NetC109_1: C109.1 R136.2 U24.2(IN+)
NetC109_2: C109.2 R135.2 U24.3(IN-)
NetC113_1: C113.1 R142.2 U25.2(IN+)
NetC113_2: C113.2 R141.2 U25.3(IN-)
NetC117_1: C117.1 R148.2 U26.2(IN+)
NetC117_2: C117.2 R147.2 U26.3(IN-)
NetR138_2: R138.2 U24.7(REF1)
NetR144_2: R144.2 U25.7(REF1)
NetR150_2: R150.2 U26.7(REF1)

### Channels
U_1231: designators end in _1; ports IA=IA1 IB=IB1 IC=IC1 Ph-A=Ph-A1 Ph-B=Ph-B1 Ph-C=Ph-C1 VA-Motor=VA_Motor1 VA=VA1 VB-Motor=VB_Motor1 VB=VB1 VC-Motor=VC_Motor1 VC=VC1
U_1232: designators end in _2; ports IA=IA2 IB=IB2 IC=IC2 Ph-A=Ph-A2 Ph-B=Ph-B2 Ph-C=Ph-C2 VA-Motor=VA_Motor2 VA=VA2 VB-Motor=VB_Motor2 VB=VB2 VC-Motor=VC_Motor2 VC=VC2

### Notes on the sheet
- 电流放大器，OUT=1/2VS
- 80V (abs max)
- scaled to 3.3v

### Library data of the parts
C108-C119 = Cap: Capacitor; Published: 8-Jun-2000; LatestRevisionDate: 17-Jul-2002; LatestRevisionNote: Re-released for DXP Platform.; PackageReference: RAD-0.3; Publisher: Altium Limited; PackageDescription: Radial Cap, Thru-Hole; 2 Leads; 0.3 in Pin Spacing
  C108 C112 C116: Value: 0.033uF
  C109 C113 C117: Value: 1500pF
  C110 C111 C114 C115 C118 C119: Value: 0.1uF
R133-R150 = 0603 100KΩ (1003) 1%_4: 贴片电阻; Value: 1MΩ(1%); ComponentLink1Description: 供应商链接; ComponentLink1URL: http://www.szlcsc.com/product/details_26546.html; Package: 0603; Supplier: LC; SuppliersPartNumber: C25803
U24-U26 = INA240A1PW: No Description Available; Mfr_Name: Texas Instruments; Copyright: Copyright (C) 2024 Ultra Librarian. All rights reserved.; Manufacturer_Part_Number: INA240A1PW; RefDes: RefDes; Type: DEV

## Sheet Phase Current Voltage Sense.SchDoc
size A4
Used 2 times, as channels U_Phase Current Voltage Sense1, U_Phase Current Voltage Sense2. Parts and nets are listed once, with the designators drawn on the sheet.
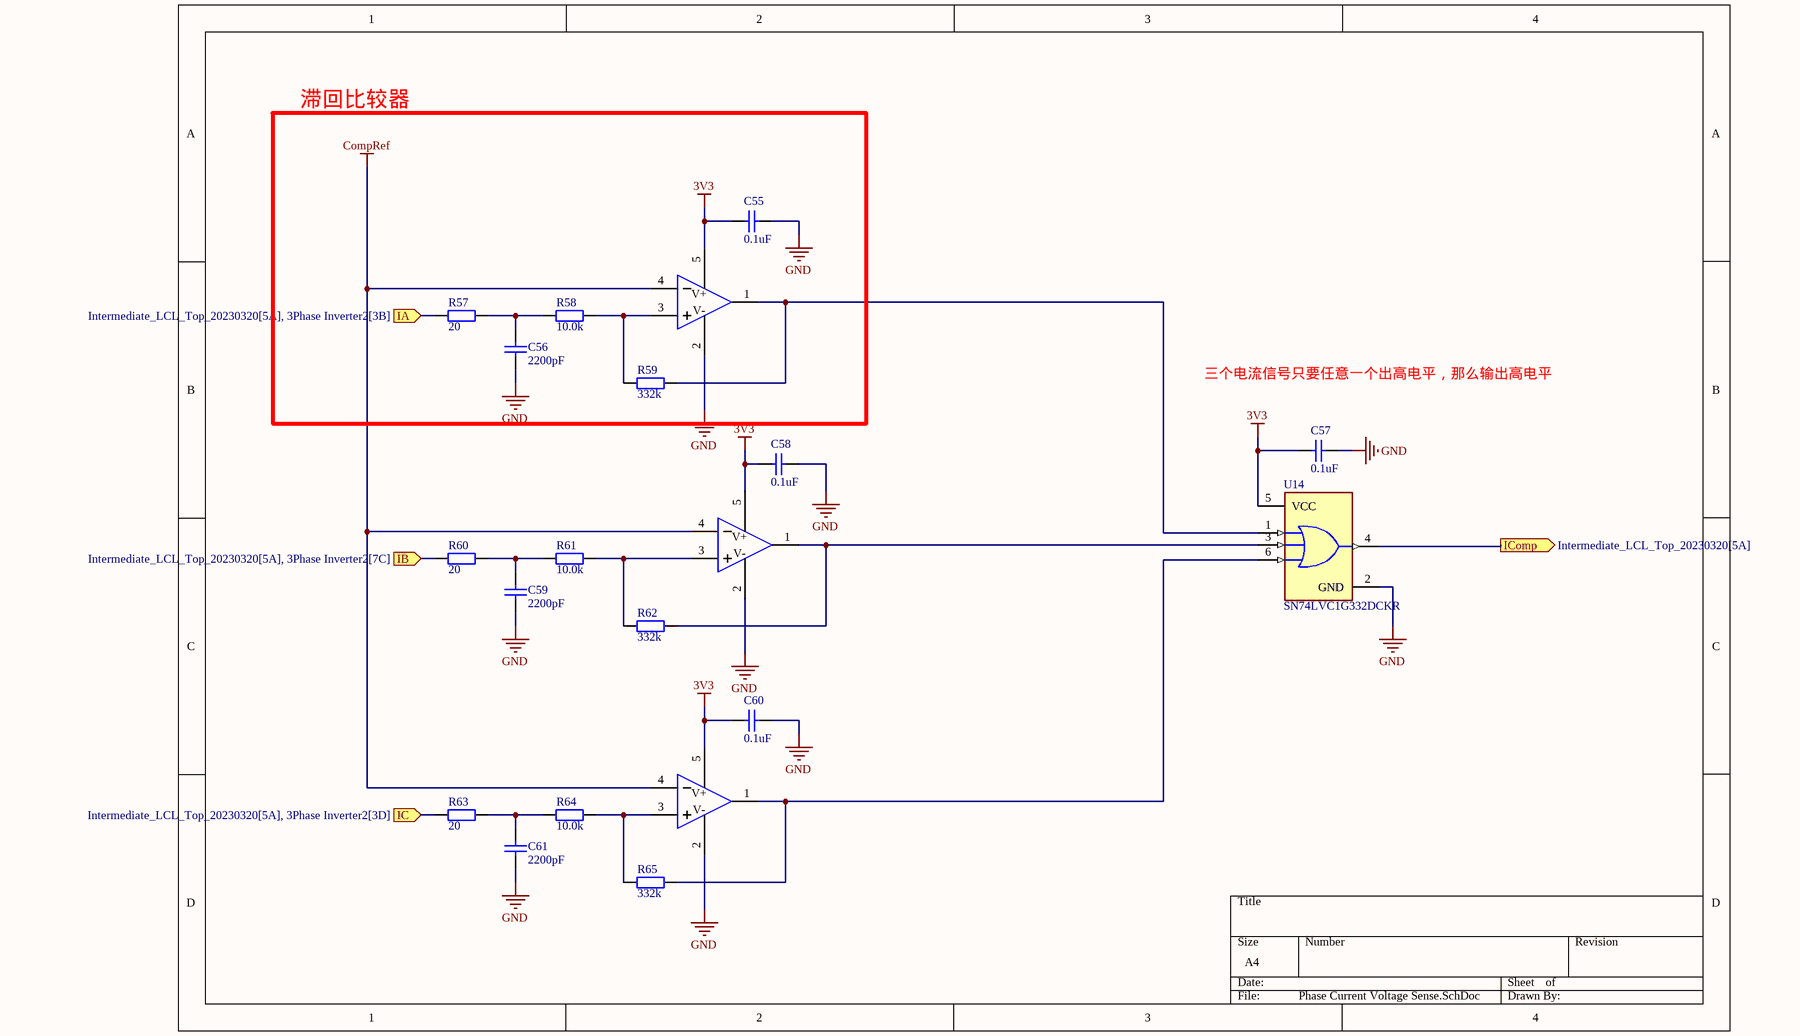
[diagram p13: Phase Current Voltage Sense.SchDoc]

### Parts
C55  0.1uF  [CAPC1608X06N]
C56  2200pF  [CAPC1608X06N]
C57  0.1uF  [CAPC1608X06N]
C58  0.1uF  [CAPC1608X06N]
C59  2200pF  [CAPC1608X06N]
C60  0.1uF  [CAPC1608X06N]
C61  2200pF  [CAPC1608X06N]
R57  20  [RESC1608X05N]
R58  10.0k  [RESC1608X05N]
R59  332k  [RESC1608X05N]
R60  20  [RESC1608X05N]
R61  10.0k  [RESC1608X05N]
R62  332k  [RESC1608X05N]
R63  20  [RESC1608X05N]
R64  10.0k  [RESC1608X05N]
R65  332k  [RESC1608X05N]
U13  TLV3201AIDBVR  [SOT-23-5_L3.0-W1.7-P0.95-LS2.8-BR]  (value not drawn)
U14  SN74LVC1G332DCKR  [FP-DCK0006A-MFG]
U15  TLV3201AIDBVR  [SOT-23-5_L3.0-W1.7-P0.95-LS2.8-BR]  (value not drawn)
U16  TLV3201AIDBVR  [SOT-23-5_L3.0-W1.7-P0.95-LS2.8-BR]  (value not drawn)

### Ports
IA (in, see Intermediate_LCL_Top_20230320[5A], 3Phase Inverter2[3B]), IB (in, see Intermediate_LCL_Top_20230320[5A], 3Phase Inverter2[7C]), IC (in, see Intermediate_LCL_Top_20230320[5A], 3Phase Inverter2[3D]), IComp (out, see Intermediate_LCL_Top_20230320[5A])

### Nets
3V3: C55.1 C57.1 C58.1 C60.1 U13.5(VCC) U14.5(VCC) U15.5(VCC) U16.5(VCC)
CompRef: U13.4(IN-) U15.4(IN-) U16.4(IN-)
GND: C55.2 C56.2 C57.2 C58.2 C59.2 C60.2 C61.2 U13.2(GND) U14.2(GND) U15.2(GND) U16.2(GND)
IA: R57.2 ; port IA
IB: R60.2 ; port IB
IC: R63.2 ; port IC
IComp: U14.4(Y) ; port IComp
NetC56_1: C56.1 R57.1 R58.2
NetC59_1: C59.1 R60.1 R61.2
NetC61_1: C61.1 R63.1 R64.2
NetR58_1: R58.1 R59.2 U13.3(IN+)
NetR59_1: R59.1 U13.1(OUT) U14.1(A)
NetR61_1: R61.1 R62.2 U15.3(IN+)
NetR62_1: R62.1 U14.3(B) U15.1(OUT)
NetR64_1: R64.1 R65.2 U16.3(IN+)
NetR65_1: R65.1 U14.6(C) U16.1(OUT)

### Channels
U_Phase Current Voltage Sense1: designators end in _1; ports IA=IA1 IB=IB1 IC=IC1 IComp=IComp1
U_Phase Current Voltage Sense2: designators end in _2; ports IA=IA2 IB=IB2 IC=IC2 IComp=IComp2

### Notes on the sheet
- 滞回比较器
- 三个电流信号只要任意一个出高电平，那么输出高电平
- (in symbol TLV3201AIDBVR) V+; V-

### Library data of the parts
C55-C61 = Cap: Capacitor; Published: 8-Jun-2000; LatestRevisionDate: 17-Jul-2002; LatestRevisionNote: Re-released for DXP Platform.; PackageReference: RAD-0.3; Publisher: Altium Limited; PackageDescription: Radial Cap, Thru-Hole; 2 Leads; 0.3 in Pin Spacing
  C55 C57 C58 C60: Value: 0.1uF
  C56 C59 C61: Value: 2200pF
R57-R65 = 0603 100KΩ (1003) 1%_4: 贴片电阻; Value: 1MΩ(1%); ComponentLink1Description: 供应商链接; ComponentLink1URL: http://www.szlcsc.com/product/details_26546.html; Package: 0603; Supplier: LC; SuppliersPartNumber: C25803
U13 U15 U16 = TLV3201AIDBVR: as U6 on sheet power; Symbol: TLV3201AIDBVR; Device: TLV3201AIDBVR; LCSC Part Name: TLV3201AIDBVR; Supplier Part: C105188; Manufacturer Part: TLV3201AIDBVR; Supplier Footprint: SOT-23-5; JLCPCB Part Class: Extended Part; Datasheet: https://www.ti.com/cn/lit/gpn/tlv3201; Supplier: LCSC; Convert to PCB: yes; Output Mode: -; Rail-to-Rail: -; Operating Temperature: -40℃~+125℃
U14 = CMP-0859-00464-4: IC GATE OR 1CH 3-INP SC70-6; Manufacturer: Texas Instruments; Min Supply Voltage: 1.65V; Number Of Circuits: 1; Nominal Supply Current: 10uA; Number Of Inputs: 3; Max Supply Voltage: 5.5V; Propagation Delay: 20ns; Standoff Height: 0mm; Logic Function Desc: Non-Inverting; Manufacturer Part Number: SN74LVC1G332DCKR; Automotive: No; Temperature: -40°C to +125°C; Device Class L1: Integrated Circuits (ICs); ComponentLink2URL: http://www.ti.com/lit/ds/symlink/sn74lvc1g332.pdf; RoHS: TRUE; Digikey Description: IC GATE OR 1CH 3-INP SC70-6; Octopart: https://octopart.com/sn74lvc1g332dckr-texas+instruments-464861; Ambient Temperature Range Low: -40°C; Number Of Outputs: 1; Height: 1.1mm; Device Class L2: Logic ICs; Mouser Description: Logic Gates Single 3-Input Pos- OR Gate; ComponentLink2Description: Datasheet; Package: DCK0006A; Temperature Range Low: -40°C; Ambient Temperature Range High: +125°C; Temperature Range High: +125°C; Category: IC; Device Class L3: Logic Gates; Lead Free: Yes